# Altium project pcb_rev01.PrjPcb
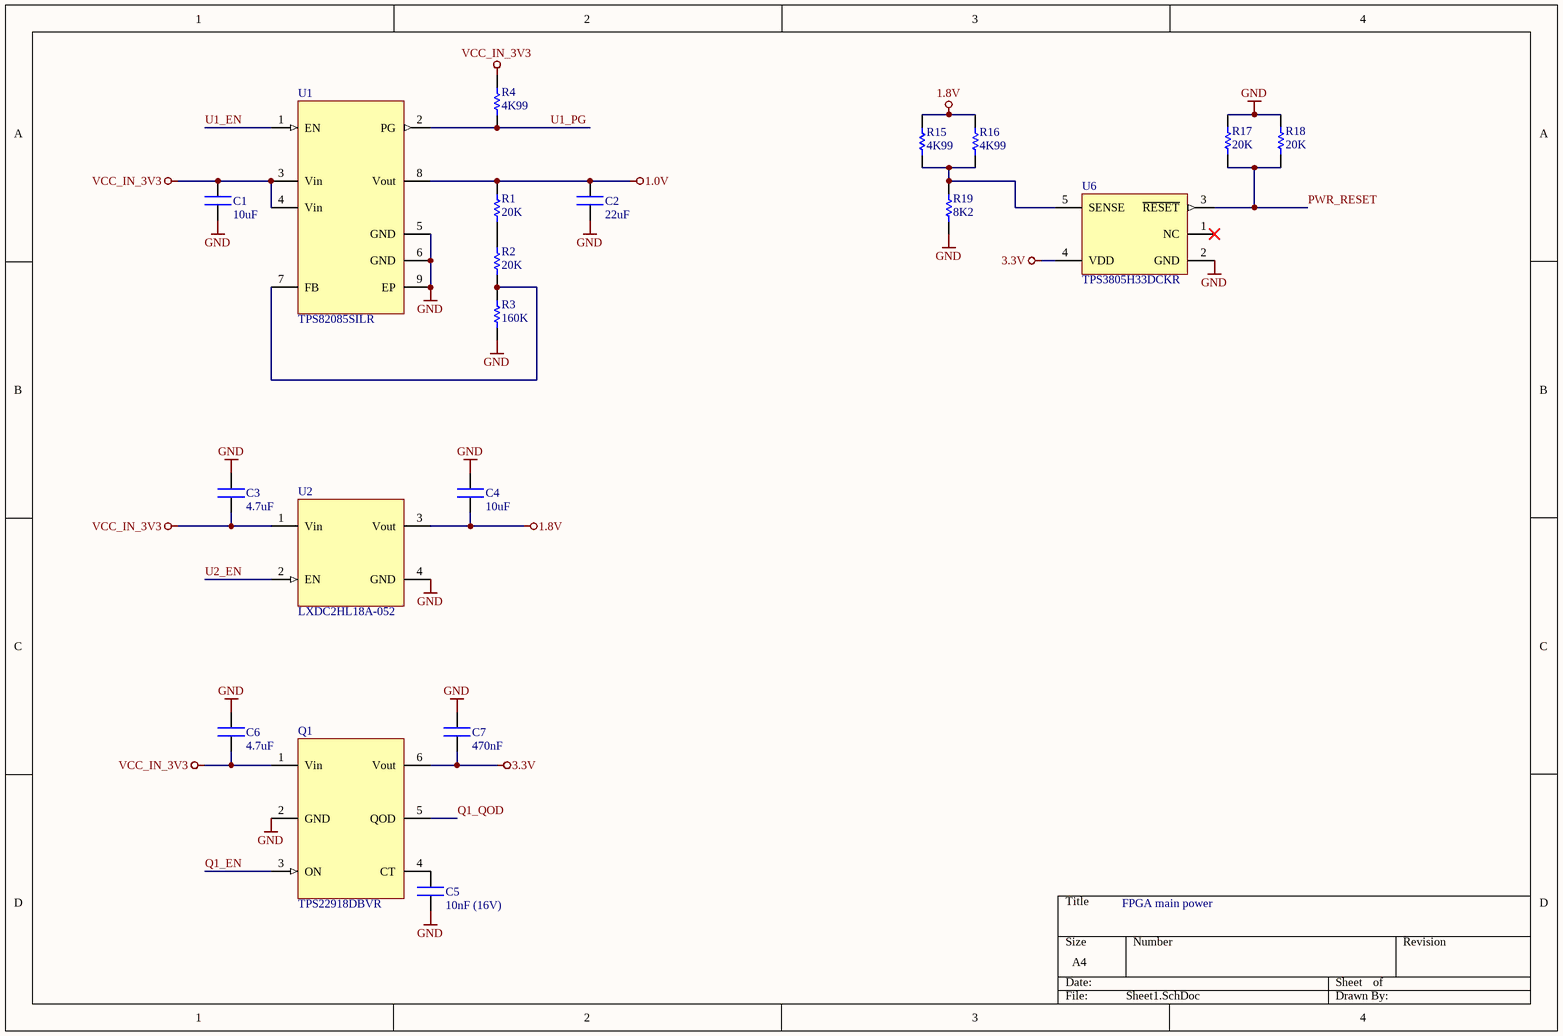
[diagram p0: Sheet1.SchDoc]
13 sheets, 174 parts. Net scope: global (net labels, ports and power ports of the same name join across sheets).
Board file: PCB1.PcbDoc
Sheets:
  Sheet1.SchDoc
  Sheet2.SchDoc
  Sheet3.SchDoc
  Sheet4.SchDoc
  Sheet5.SchDoc
  Sheet6.SchDoc
  Sheet7.SchDoc
  Sheet8.SchDoc
  Sheet9.SchDoc
  Sheet10.SchDoc
  Sheet11.SchDoc
  Sheet12.SchDoc
  Sheet13.SchDoc

## Sheet Sheet1.SchDoc
size A4

### Parts
C1  10uF  [CAPC1608X08N]
C2  22uF  [CAPC1608X08N]
C3  4.7uF  [CAPC1005X05N]
C4  10uF  [CAPC1608X08N]
C5  10nF (16V)  [CAPC1005X05N]
C6  4.7uF  [CAPC1005X05N]
C7  470nF  [CAPC1005X05N]
Q1  TPS22918DBVR  [TPS22918DBVR]
R1  20K  [RESC1005X05N]
R2  20K  [RESC1005X05N]
R3  160K  [RESC1005X05N]
R4  4K99  [RESC1005X05N]
R15  4K99  [RESC1005X05N]
R16  4K99  [RESC1005X05N]
R17  20K  [RESC1005X05N]
R18  20K  [RESC1005X05N]
R19  8K2  [RESC1005X05N]
U1  TPS82085SILR  [TPS82085SILR]
U2  LXDC2HL18A-052  [LXDC2HL18A-052]
U6  TPS3805H33DCKR  [TPS3805H33DCKR]

### Nets
1.0V: C2.2 R1.2 U1.8(Vout)
1.8V: C4.2 R15.2 R16.2 U2.3(Vout)
3.3V: C7.2 Q1.6(Vout) U6.4(VDD)
GND: C1.1 C2.1 C3.1 C4.1 C5.1 C6.1 C7.1 Q1.2(GND) R3.1 R17.1 R18.1 R19.1 U1.5(GND) U1.6(GND) U1.9(EP) U2.4(GND) U6.2(GND)
VCC_IN_3V3: C1.2 C3.2 C6.2 Q1.1(Vin) R4.2 U1.3(Vin) U1.4(Vin) U2.1(Vin)
PWR_RESET: R17.2 R18.2 U6.3(~{RESET})
Q1_EN: Q1.3(ON)
Q1_QOD: Q1.5(QOD)
U1_EN: U1.1(EN)
U1_PG: R4.1 U1.2(PG)
U2_EN: U2.2(EN)
NetC5_2: C5.2 Q1.4(CT)
NetR1_1: R1.1 R2.2
NetR2_1: R2.1 R3.2 U1.7(FB)
NetR15_1: R15.1 R16.1 R19.2 U6.5(SENSE)

Not connected (* = marked no-connect by the designer): U6 1(NC)*

### Notes on the sheet
- FPGA main power

### Library data of the parts
C1 C2 C4 = C0603: Ceramic Chip Capacitor
  C1 C4: Value: 10uF
  C2: Value: 22uF
C3 C5-C7 = C0402: Ceramic Chip Capacitor
  C3 C6: Value: 4.7uF
  C5: Value: 10nF (16V)
  C7: Value: 470nF
Q1 = TPS22918DBVR: 5.5-V, 2-A, 52-mΩ On-Resistance Load Switch
R1-R4 R15-R19 = R0402: Ceramic Chip Resistor
  R1 R2 R17 R18: Value: 20K
  R3: Value: 160K
  R4 R15 R16: Value: 4K99
  R19: Value: 8K2
U1 = TPS82085SILR: 3-A High Efficiency Step-Down Converter
U2 = LXDC2HL18A-052: Low power step-down DC-DC converter.
U6 = TPS3805H33DCKR: Dual Voltage Detector, 2 Supply Monitored, -40 to 85 degC, 5-pin SC70 (DCK), Green (RoHS & no Sb/Br); Manufacturer: Texas Instruments; # of supplies monitored: 2; Iq(Typ)(uA): 3; Output Driver Type / Reset Output: Active-low, Push-pull; Rating: Catalog; Reset Threshold Accuracy(%): 1.5; SubFamily: Supervisor and Reset IC; Threshold Voltage 1 (typ)(Typ)(V): 3.05; Threshold Voltage 2 (typ)(Typ)(V): Adjustable; VCC(Max)(V): 6; VCC(Min)(V): 1.3; DatasheetVersion: SLVS392A; PackageVersion: revG, Jan-2007; PackageReference: DCK5; PackageDescription: 5-Pin Plastic Small-Outline Package, 2 x 1.3 mm Body, 0.65 mm Pitch, 2.1 mm Lead Span; Supplier 1: Digi-Key; Supplier Part Number 1: 296-13407-2-ND; Supplier 2: Digi-Key; Supplier Part Number 2: 296-13407-1-ND; Supplier 3: Digi-Key; Supplier Part Number 3: 296-13407-6-ND; Supplier 4: Newark; Supplier Part Number 4: 77C0394; Supplier 5: Mouser; Supplier Part Number 5: 595-TPS3805H33DCKR; Mounting Technology: Surface Mount; Code_JEDEC: MO-203-AA; PartNumber: TPS3805H33DCKR; ComponentLink1Description: Datasheet; ComponentLink1URL: http://www.ti.com/general/docs/lit/getliterature.tsp?genericPartNumber=TPS3805H33&fileType=pdf

## Sheet Sheet2.SchDoc
size A4
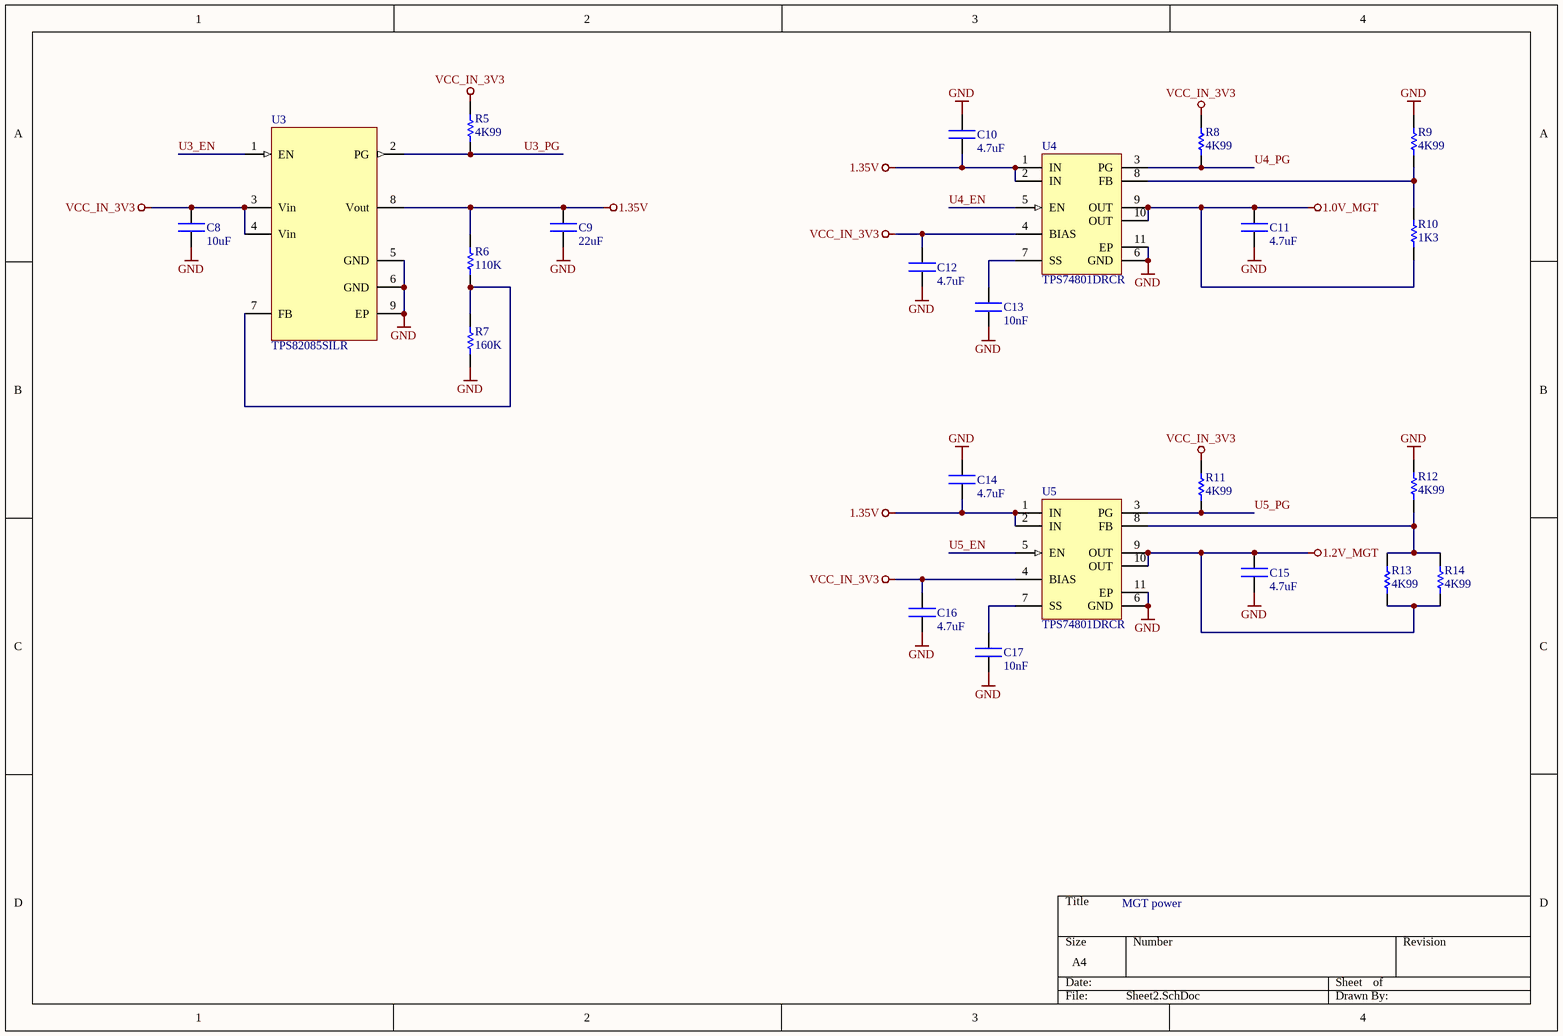
[diagram p1: Sheet2.SchDoc]

### Parts
C8  10uF  [CAPC1608X08N]
C9  22uF  [CAPC1608X08N]
C10  4.7uF  [CAPC1005X05N]
C11  4.7uF  [CAPC1005X05N]
C12  4.7uF  [CAPC1005X05N]
C13  10nF  [CAPC1005X05N]
C14  4.7uF  [CAPC1005X05N]
C15  4.7uF  [CAPC1005X05N]
C16  4.7uF  [CAPC1005X05N]
C17  10nF  [CAPC1005X05N]
R5  4K99  [RESC1005X05N]
R6  110K  [RESC1005X05N]
R7  160K  [RESC1005X05N]
R8  4K99  [RESC1005X05N]
R9  4K99  [RESC1005X05N]
R10  1K3  [RESC1005X05N]
R11  4K99  [RESC1005X05N]
R12  4K99  [RESC1005X05N]
R13  4K99  [RESC1005X05N]
R14  4K99  [RESC1005X05N]
U3  TPS82085SILR  [TPS82085SILR]
U4  TPS74801DRCR  [TPS74801DRCR]
U5  TPS74801DRCR  [TPS74801DRCR]

### Nets
1.0V_MGT: C11.2 R10.2 U4.9(OUT) U4.10(OUT)
1.2V_MGT: C15.2 R13.1 R14.1 U5.9(OUT) U5.10(OUT)
1.35V: C9.2 C10.2 C14.2 R6.2 U3.8(Vout) U4.1(IN) U4.2(IN) U5.1(IN) U5.2(IN)
GND: C8.1 C9.1 C10.1 C11.1 C12.1 C13.1 C14.1 C15.1 C16.1 C17.1 R7.1 R9.2 R12.1 U3.5(GND) U3.6(GND) U3.9(EP) U4.6(GND) U4.11(EP) U5.6(GND) U5.11(EP)
VCC_IN_3V3: C8.2 C12.2 C16.2 R5.2 R8.2 R11.2 U3.3(Vin) U3.4(Vin) U4.4(BIAS) U5.4(BIAS)
U3_EN: U3.1(EN)
U3_PG: R5.1 U3.2(PG)
U4_EN: U4.5(EN)
U4_PG: R8.1 U4.3(PG)
U5_EN: U5.5(EN)
U5_PG: R11.1 U5.3(PG)
NetC13_2: C13.2 U4.7(SS)
NetC17_2: C17.2 U5.7(SS)
NetR6_1: R6.1 R7.2 U3.7(FB)
NetR9_1: R9.1 R10.1 U4.8(FB)
NetR12_2: R12.2 R13.2 R14.2 U5.8(FB)

### Notes on the sheet
- MGT power

### Library data of the parts
C8 C9 = C0603: Ceramic Chip Capacitor
  C8: Value: 10uF
  C9: Value: 22uF
C10-C17 = C0402: Ceramic Chip Capacitor
  C10-C12 C14-C16: Value: 4.7uF
  C13 C17: Value: 10nF
R5-R14 = R0402: Ceramic Chip Resistor
  R5 R8 R9 R11-R14: Value: 4K99
  R6: Value: 110K
  R7: Value: 160K
  R10: Value: 1K3
U3 = TPS82085SILR: 3-A High Efficiency Step-Down Converter
U4 U5 = TPS74801DRCR: Single Output LDO, 1.5 A, Adjustable 0.8 to 3.6 V Output, 0.8 to 5.5 V Input, with Programmable Soft Start, 10-pin SON (DRC), -40 to 125 degC, Green (RoHS & no Sb/Br); Manufacturer: Texas Instruments; Accuracy(%): 2; Iout(Max)(A): 1.5; Iq(Typ)(mA): 1; Power Good: TRUE; Rating: Catalog; SubFamily: Single Channel LDO; Vdo(Typ)(mV): 60; Vin(Max)(V): 5.5; Vin(Min)(V): 0.8; Vout Adj(Max)(V): 3.6; DatasheetVersion: SBVS074J; PackageVersion: 4204102-3/L; PackageReference: DRC10-2400X1650TP; PackageDescription: 10-Pin Plastic Small Outline, Body 3 x 3 mm, Pitch 0.5 mm; Supplier 1: Digi-Key; Supplier Part Number 1: 296-21563-2-ND; Supplier 2: Digi-Key; Supplier Part Number 2: 296-21563-1-ND; Supplier 3: Digi-Key; Supplier Part Number 3: 296-21563-6-ND; Supplier 4: Newark; Supplier Part Number 4: 30M1868; Supplier 5: Mouser; Supplier Part Number 5: 595-TPS74801DRCR; Eco-Plan: Green (RoHS & no Sb/Br); Vout Adj(Min)(V): 0.8; Mounting Technology: Surface Mount; PartNumber: TPS74801DRCR; ComponentLink1Description: Manufacturer URL; ComponentLink1URL: http://www.ti.com/; ComponentLink2Description: Datasheet; ComponentLink2URL: http://www.ti.com/general/docs/lit/getliterature.tsp?genericPartNumber=TPS74801&fileType=pdf; ComponentLink3Description: Package Specification; ComponentLink3URL: http://www.ti.com/litv/pdf/mpds117k; ComponentLink4Description: URL Link1; ComponentLink4URL: Samples URL:http://www.ti.com/product/tps74801#samples

## Sheet Sheet3.SchDoc
size A4
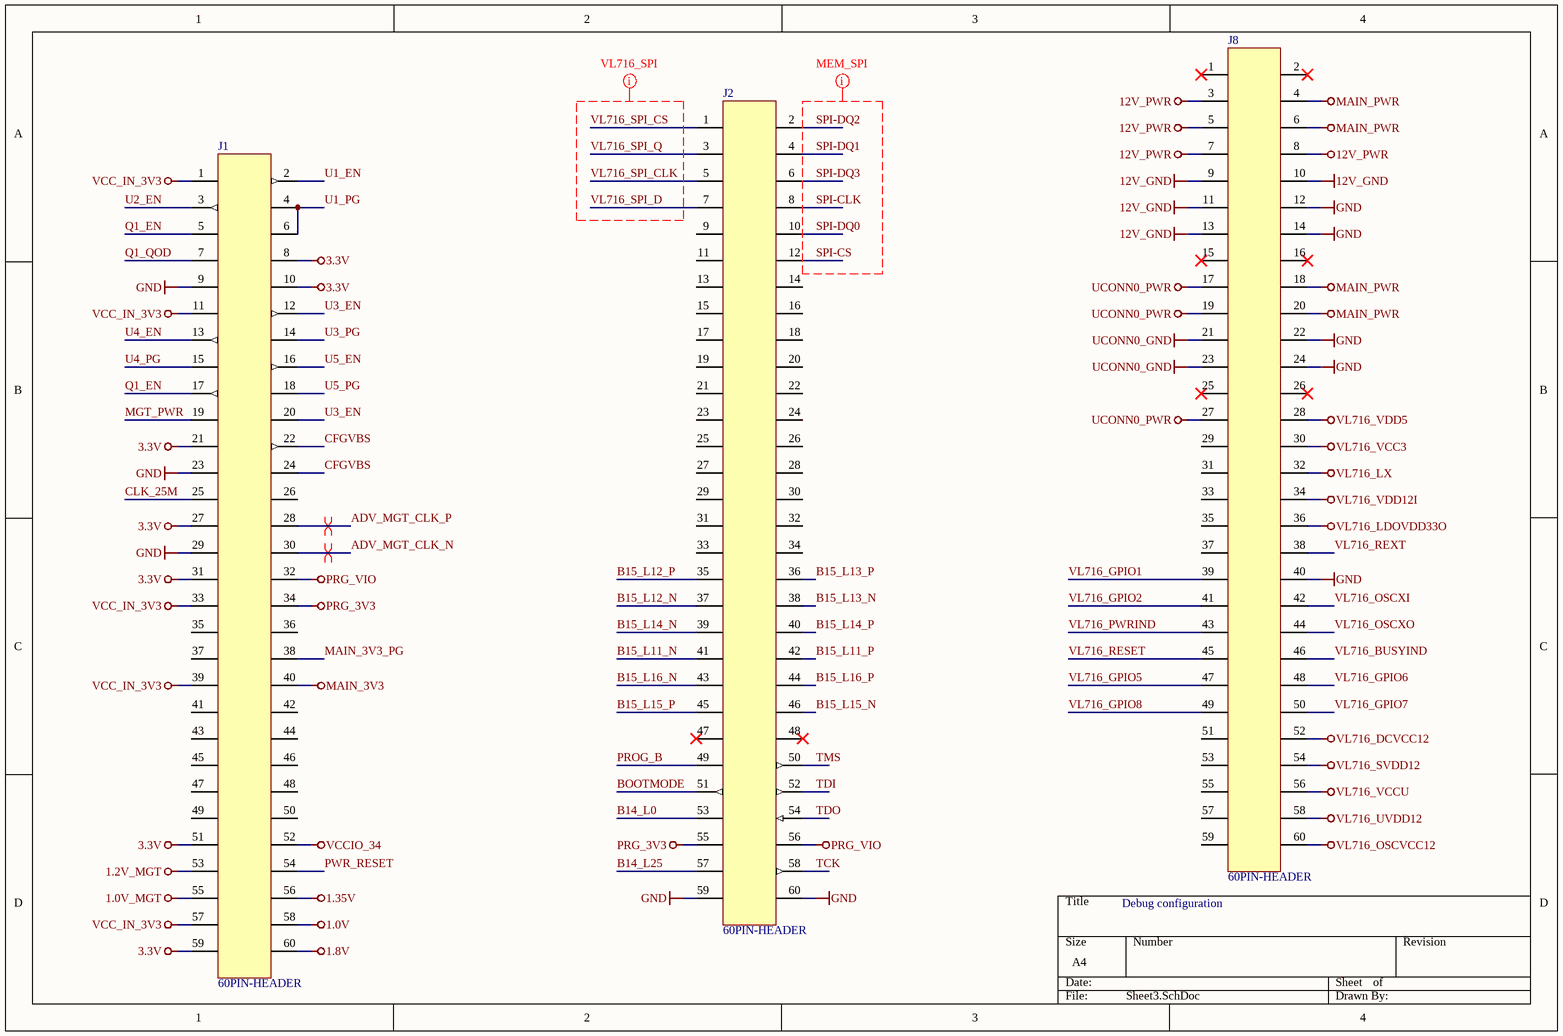
[diagram p2: Sheet3.SchDoc]

### Parts
J1  60PIN-HEADER  [60PIN-HEADER]
J2  60PIN-HEADER  [60PIN-HEADER]
J8  60PIN-HEADER  [60PIN-HEADER]

### Nets
1.0V: J1.58
1.0V_MGT: J1.55
1.2V_MGT: J1.53
1.8V: J1.60
1.35V: J1.56
3.3V: J1.8 J1.10 J1.21 J1.27 J1.31 J1.51 J1.59
12V_GND: J8.9 J8.10 J8.11 J8.13
12V_PWR: J8.3 J8.5 J8.7 J8.8
GND: J1.9 J1.23 J1.29 J2.59 J2.60 J8.12 J8.14 J8.22 J8.24 J8.40
MAIN_3V3: J1.40
MAIN_PWR: J8.4 J8.6 J8.18 J8.20
PRG_3V3: J1.34 J2.55
PRG_VIO: J1.32 J2.56
UCONN0_GND: J8.21 J8.23
UCONN0_PWR: J8.17 J8.19 J8.27
VCC_IN_3V3: J1.1 J1.11 J1.33 J1.39 J1.57
VCCIO_34: J1.52
VL716_DCVCC12: J8.52
VL716_LDOVDD33O: J8.36
VL716_LX: J8.32
VL716_OSCVCC12: J8.60
VL716_SVDD12: J8.54
VL716_UVDD12: J8.58
VL716_VCC3: J8.30
VL716_VCCU: J8.56
VL716_VDD5: J8.28
VL716_VDD12I: J8.34
ADV_MGT_CLK_N: J1.30
ADV_MGT_CLK_P: J1.28
B14_L0: J2.53
B14_L25: J2.57
B15_L11_N: J2.41
B15_L11_P: J2.42
B15_L12_N: J2.37
B15_L12_P: J2.35
B15_L13_N: J2.38
B15_L13_P: J2.36
B15_L14_N: J2.39
B15_L14_P: J2.40
B15_L15_N: J2.46
B15_L15_P: J2.45
B15_L16_N: J2.43
B15_L16_P: J2.44
BOOTMODE: J2.51
CFGVBS: J1.22 J1.24
CLK_25M: J1.25
MAIN_3V3_PG: J1.38
MGT_PWR: J1.19
PROG_B: J2.49
PWR_RESET: J1.54
Q1_EN: J1.5 J1.17
Q1_QOD: J1.7
SPI-CLK: J2.8
SPI-CS: J2.12
SPI-DQ0: J2.10
SPI-DQ1: J2.4
SPI-DQ2: J2.2
SPI-DQ3: J2.6
TCK: J2.58
TDI: J2.52
TDO: J2.54
TMS: J2.50
U1_EN: J1.2
U1_PG: J1.4 J1.6
U2_EN: J1.3
U3_EN: J1.12 J1.20
U3_PG: J1.14
U4_EN: J1.13
U4_PG: J1.15
U5_EN: J1.16
U5_PG: J1.18
VL716_BUSYIND: J8.46
VL716_GPIO1: J8.39
VL716_GPIO2: J8.41
VL716_GPIO5: J8.47
VL716_GPIO6: J8.48
VL716_GPIO7: J8.50
VL716_GPIO8: J8.49
VL716_OSCXI: J8.42
VL716_OSCXO: J8.44
VL716_PWRIND: J8.43
VL716_RESET: J8.45
VL716_REXT: J8.38
VL716_SPI_CLK: J2.5
VL716_SPI_CS: J2.1
VL716_SPI_D: J2.7
VL716_SPI_Q: J2.3

Not connected (* = marked no-connect by the designer): J1 26 35 36 37 41 42 43 44 45 46 47 48 49 50; J2 9 11 13 14 15 16 17 18 19 20 21 22 23 24 25 26 27 28 29 30 31 32 33 34 47* 48*; J8 1* 2* 15* 16* 25* 26* 29 31 33 35 37 51 53 55 57 59

### Layout directives
differential pair: ADV_MGT_CLK_N, ADV_MGT_CLK_P
net class VL716_SPI: VL716_SPI_CLK, VL716_SPI_CS, VL716_SPI_D, VL716_SPI_Q
net class MEM_SPI: SPI-CLK, SPI-CS, SPI-DQ0, SPI-DQ1, SPI-DQ2, SPI-DQ3

### Notes on the sheet
- (near J8) Debug configuration

### Library data of the parts
J1 J2 J8 = 60PIN-HEADER: 2.54mm 60-pin header

## Sheet Sheet4.SchDoc
size A4
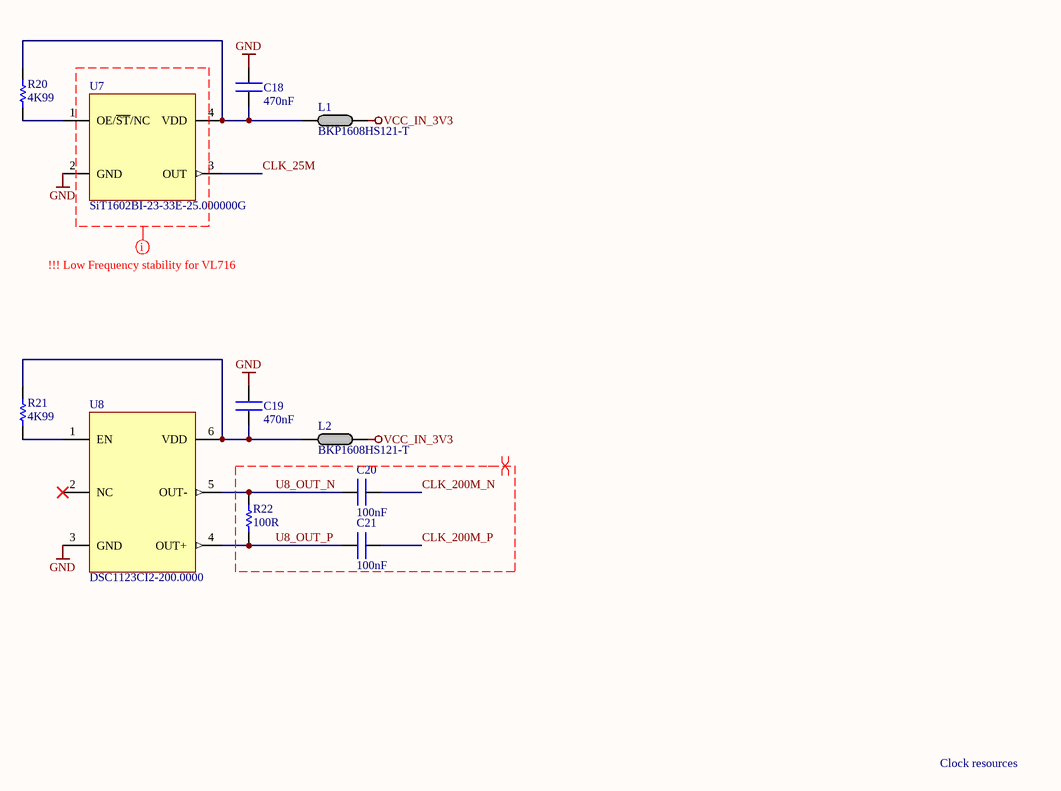
[diagram p3: Sheet4.SchDoc]

### Parts
C18  470nF  [CAPC1005X05N]
C19  470nF  [CAPC1005X05N]
C20  100nF  [CAPC1005X05N]
C21  100nF  [CAPC1005X05N]
L1  BKP1608HS121-T  [INDC1608X08N]
L2  BKP1608HS121-T  [INDC1608X08N]
R20  4K99  [RESC1005X05N]
R21  4K99  [RESC1005X05N]
R22  100R  [RESC1005X05N]
U7  SiT1602BI-23-33E-25.000000G  [SiT1602BI-23-33E-25.000000G]
U8  DSC1123CI2-200.0000  [DSC1123CI2-200.0000]

### Nets
GND: C18.2 C19.2 U7.2(GND) U8.3(GND)
VCC_IN_3V3: L1.2 L2.2
CLK_25M: U7.3(OUT)
CLK_200M_N: C20.1
CLK_200M_P: C21.1
U8_OUT_N: C20.2 R22.1 U8.5(OUT-)
U8_OUT_P: C21.2 R22.2 U8.4(OUT+)
NetC18_1: C18.1 L1.1 R20.1 U7.4(VDD)
NetC19_1: C19.1 L2.1 R21.1 U8.6(VDD)
NetR20_2: R20.2 U7.1(OE/~{ST}/NC)
NetR21_2: R21.2 U8.1(EN)

Not connected (* = marked no-connect by the designer): U8 2(NC)*

### Layout directives
differential pair: CLK_200M_N, CLK_200M_P, U8_OUT_N, U8_OUT_P
mark named !!! Low Frequency stability for VL716: (no net found under the mark)

### Notes on the sheet
- Clock resources

### Library data of the parts
C18-C21 = C0402: Ceramic Chip Capacitor
  C18 C19: Value: 470nF
  C20 C21: Value: 100nF
L1 L2 = BKP1608HS121-T: MULTILAYER CHIP BEAD INDUCTOR FOR POWER LINES
R20-R22 = R0402: Ceramic Chip Resistor
  R20 R21: Value: 4K99
  R22: Value: 100R
U7 = SiT1602BI-23-33E-25.000000G: Low Power, Standard Frequency Oscillator
U8 = DSC1123CI2-200.0000: Low-Jitter Precision LVDS Oscillator

## Sheet Sheet5.SchDoc
size A4
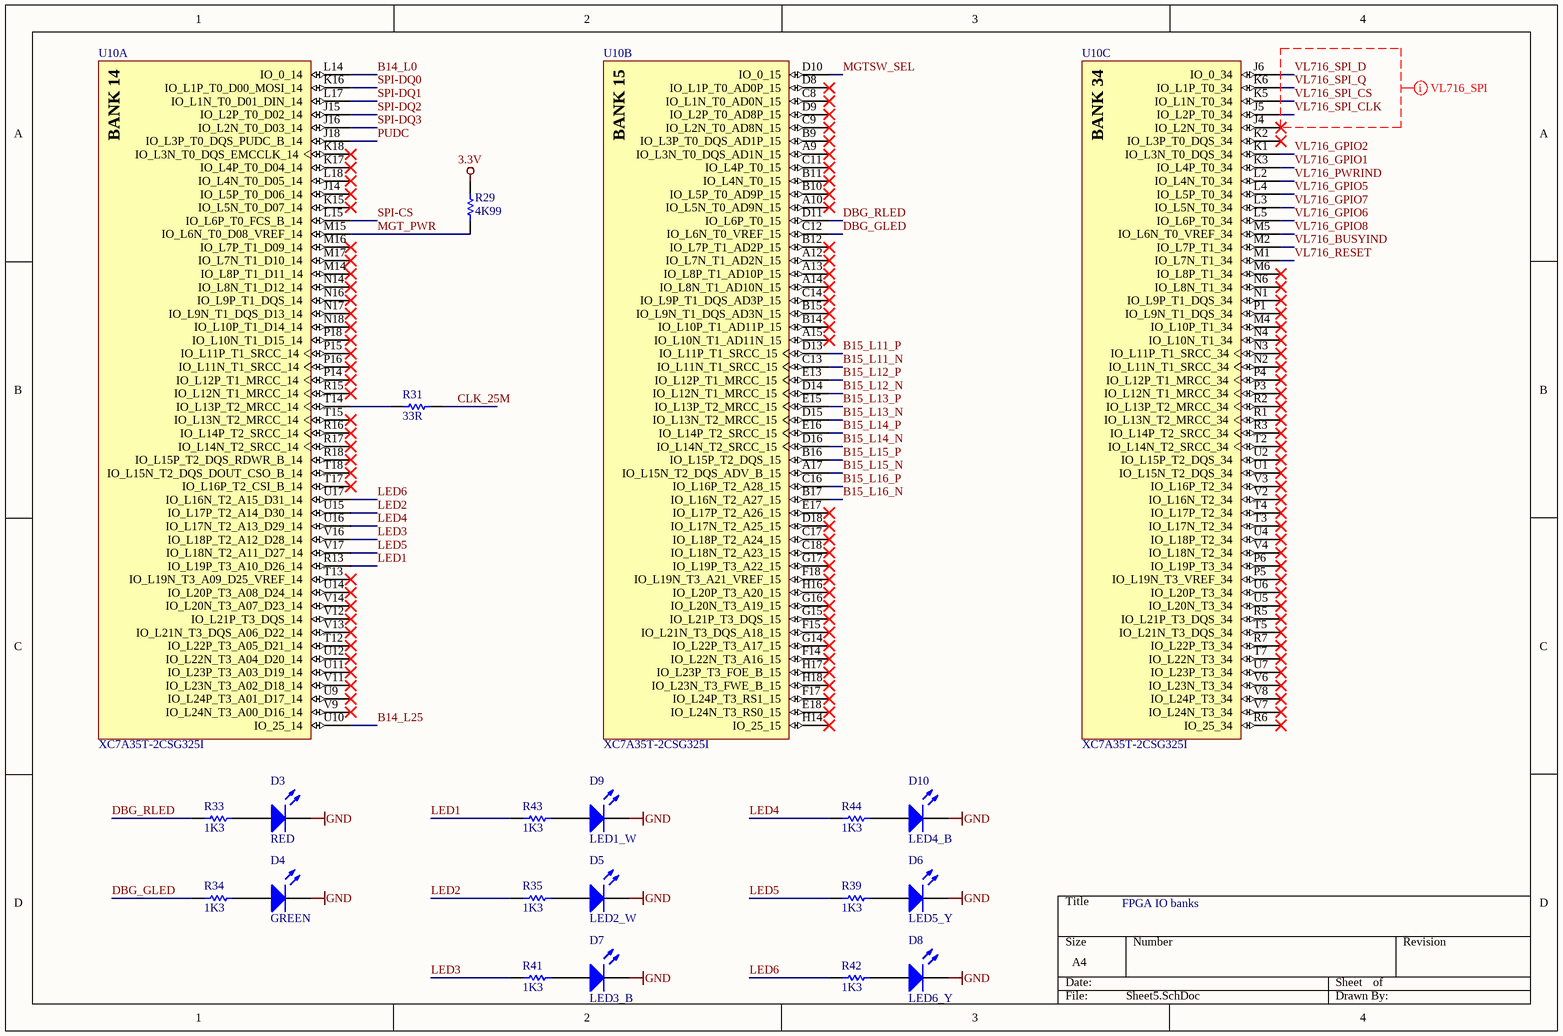
[diagram p4: Sheet5.SchDoc]

### Parts
D3  RED  [LEDC2012X10N]
D4  GREEN  [LEDC2012X10N]
D5  LED2_W  [LEDC2012X10N]
D6  LED5_Y  [LEDC2012X10N]
D7  LED3_B  [LEDC2012X10N]
D8  LED6_Y  [LEDC2012X10N]
D9  LED1_W  [LEDC2012X10N]
D10  LED4_B  [LEDC2012X10N]
R29  4K99  [RESC1005X05N]
R31  33R  [RESC1005X05N]
R33  1K3  [RESC1005X05N]
R34  1K3  [RESC1005X05N]
R35  1K3  [RESC1005X05N]
R39  1K3  [RESC1005X05N]
R41  1K3  [RESC1005X05N]
R42  1K3  [RESC1005X05N]
R43  1K3  [RESC1005X05N]
R44  1K3  [RESC1005X05N]
U10  XC7A35T-2CSG325I  [XC7A35T-2CSG325I]  (parts A,B,C of 9)

### Nets
3.3V: R29.1
GND: D3.1(K) D4.1(K) D5.1(K) D6.1(K) D7.1(K) D8.1(K) D9.1(K) D10.1(K)
B14_L0: U10.L14(IO_0_14)
B14_L25: U10.U10(IO_25_14)
B15_L11_N: U10.C13(IO_L11N_T1_SRCC_15)
B15_L11_P: U10.D13(IO_L11P_T1_SRCC_15)
B15_L12_N: U10.D14(IO_L12N_T1_MRCC_15)
B15_L12_P: U10.E13(IO_L12P_T1_MRCC_15)
B15_L13_N: U10.D15(IO_L13N_T2_MRCC_15)
B15_L13_P: U10.E15(IO_L13P_T2_MRCC_15)
B15_L14_N: U10.D16(IO_L14N_T2_SRCC_15)
B15_L14_P: U10.E16(IO_L14P_T2_SRCC_15)
B15_L15_N: U10.A17(IO_L15N_T2_DQS_ADV_B_15)
B15_L15_P: U10.B16(IO_L15P_T2_DQS_15)
B15_L16_N: U10.B17(IO_L16N_T2_A27_15)
B15_L16_P: U10.C16(IO_L16P_T2_A28_15)
CLK_25M: R31.2
DBG_GLED: R34.2 U10.C12(IO_L6N_T0_VREF_15)
DBG_RLED: R33.2 U10.D11(IO_L6P_T0_15)
LED1: R43.2 U10.R13(IO_L19P_T3_A10_D26_14)
LED2: R35.2 U10.U15(IO_L17P_T2_A14_D30_14)
LED3: R41.2 U10.V16(IO_L18P_T2_A12_D28_14)
LED4: R44.2 U10.U16(IO_L17N_T2_A13_D29_14)
LED5: R39.2 U10.V17(IO_L18N_T2_A11_D27_14)
LED6: R42.2 U10.U17(IO_L16N_T2_A15_D31_14)
MGT_PWR: R29.2 U10.M15(IO_L6N_T0_D08_VREF_14)
MGTSW_SEL: U10.D10(IO_0_15)
PUDC: U10.J18(IO_L3P_T0_DQS_PUDC_B_14)
SPI-CS: U10.L15(IO_L6P_T0_FCS_B_14)
SPI-DQ0: U10.K16(IO_L1P_T0_D00_MOSI_14)
SPI-DQ1: U10.L17(IO_L1N_T0_D01_DIN_14)
SPI-DQ2: U10.J15(IO_L2P_T0_D02_14)
SPI-DQ3: U10.J16(IO_L2N_T0_D03_14)
VL716_BUSYIND: U10.M2(IO_L7P_T1_34)
VL716_GPIO1: U10.K3(IO_L4P_T0_34)
VL716_GPIO2: U10.K1(IO_L3N_T0_DQS_34)
VL716_GPIO5: U10.L4(IO_L5P_T0_34)
VL716_GPIO6: U10.L5(IO_L6P_T0_34)
VL716_GPIO7: U10.L3(IO_L5N_T0_34)
VL716_GPIO8: U10.M5(IO_L6N_T0_VREF_34)
VL716_PWRIND: U10.L2(IO_L4N_T0_34)
VL716_RESET: U10.M1(IO_L7N_T1_34)
VL716_SPI_CLK: U10.J5(IO_L2P_T0_34)
VL716_SPI_CS: U10.K5(IO_L1N_T0_34)
VL716_SPI_D: U10.J6(IO_0_34)
VL716_SPI_Q: U10.K6(IO_L1P_T0_34)
NetD3_2: D3.2(A) R33.1
NetD4_2: D4.2(A) R34.1
NetD5_2: D5.2(A) R35.1
NetD6_2: D6.2(A) R39.1
NetD7_2: D7.2(A) R41.1
NetD8_2: D8.2(A) R42.1
NetD9_2: D9.2(A) R43.1
NetD10_2: D10.2(A) R44.1
NetR31_1: R31.1 U10.T14(IO_L13P_T2_MRCC_14)

Not connected (* = marked no-connect by the designer): U10 A9(IO_L3N_T0_DQS_AD1N_15)* A10(IO_L5N_T0_AD9N_15)* A12(IO_L7N_T1_AD2N_15)* A13(IO_L8P_T1_AD10P_15)* A14(IO_L8N_T1_AD10N_15)* A15(IO_L10N_T1_AD11N_15)* B9(IO_L3P_T0_DQS_AD1P_15)* B10(IO_L5P_T0_AD9P_15)* B11(IO_L4N_T0_15)* B12(IO_L7P_T1_AD2P_15)* B14(IO_L10P_T1_AD11P_15)* B15(IO_L9N_T1_DQS_AD3N_15)* C8(IO_L1N_T0_AD0N_15)* C9(IO_L2N_T0_AD8N_15)* C11(IO_L4P_T0_15)* C14(IO_L9P_T1_DQS_AD3P_15)* C17(IO_L18P_T2_A24_15)* C18(IO_L18N_T2_A23_15)* D8(IO_L1P_T0_AD0P_15)* D9(IO_L2P_T0_AD8P_15)* D18(IO_L17N_T2_A25_15)* E17(IO_L17P_T2_A26_15)* E18(IO_L24N_T3_RS0_15)* F14(IO_L22N_T3_A16_15)* F15(IO_L21N_T3_DQS_A18_15)* F17(IO_L24P_T3_RS1_15)* F18(IO_L19N_T3_A21_VREF_15)* G14(IO_L22P_T3_A17_15)* G15(IO_L21P_T3_DQS_15)* G16(IO_L20N_T3_A19_15)* G17(IO_L19P_T3_A22_15)* H14(IO_25_15)* H16(IO_L20P_T3_A20_15)* H17(IO_L23P_T3_FOE_B_15)* H18(IO_L23N_T3_FWE_B_15)* J4(IO_L2N_T0_34)* J14(IO_L5P_T0_D06_14)* K2(IO_L3P_T0_DQS_34)* K15(IO_L5N_T0_D07_14)* K17(IO_L4P_T0_D04_14)* K18(IO_L3N_T0_DQS_EMCCLK_14)* L18(IO_L4N_T0_D05_14)* M4(IO_L10P_T1_34)* M6(IO_L8P_T1_34)* M14(IO_L8P_T1_D11_14)* M16(IO_L7P_T1_D09_14)* M17(IO_L7N_T1_D10_14)* N1(IO_L9P_T1_DQS_34)* N2(IO_L11N_T1_SRCC_34)* N3(IO_L11P_T1_SRCC_34)* N4(IO_L10N_T1_34)* N6(IO_L8N_T1_34)* N14(IO_L8N_T1_D12_14)* N16(IO_L9P_T1_DQS_14)* N17(IO_L9N_T1_DQS_D13_14)* N18(IO_L10P_T1_D14_14)* P1(IO_L9N_T1_DQS_34)* P3(IO_L12N_T1_MRCC_34)* P4(IO_L12P_T1_MRCC_34)* P5(IO_L19N_T3_VREF_34)* P6(IO_L19P_T3_34)* P14(IO_L12P_T1_MRCC_14)* P15(IO_L11P_T1_SRCC_14)* P16(IO_L11N_T1_SRCC_14)* P18(IO_L10N_T1_D15_14)* R1(IO_L13N_T2_MRCC_34)* R2(IO_L13P_T2_MRCC_34)* R3(IO_L14P_T2_SRCC_34)* R5(IO_L21P_T3_DQS_34)* R6(IO_25_34)* R7(IO_L22P_T3_34)* R15(IO_L12N_T1_MRCC_14)* R16(IO_L14P_T2_SRCC_14)* R17(IO_L14N_T2_SRCC_14)* R18(IO_L15P_T2_DQS_RDWR_B_14)* T2(IO_L14N_T2_SRCC_34)* T3(IO_L17N_T2_34)* T4(IO_L17P_T2_34)* T5(IO_L21N_T3_DQS_34)* T7(IO_L22N_T3_34)* T12(IO_L22P_T3_A05_D21_14)* T13(IO_L19N_T3_A09_D25_VREF_14)* T15(IO_L13N_T2_MRCC_14)* T17(IO_L16P_T2_CSI_B_14)* T18(IO_L15N_T2_DQS_DOUT_CSO_B_14)* U1(IO_L15N_T2_DQS_34)* U2(IO_L15P_T2_DQS_34)* U4(IO_L18P_T2_34)* U5(IO_L20N_T3_34)* U6(IO_L20P_T3_34)* U7(IO_L23P_T3_34)* U9(IO_L24P_T3_A01_D17_14)* U11(IO_L23P_T3_A03_D19_14)* U12(IO_L22N_T3_A04_D20_14)* U14(IO_L20P_T3_A08_D24_14)* V2(IO_L16N_T2_34)* V3(IO_L16P_T2_34)* V4(IO_L18N_T2_34)* V6(IO_L23N_T3_34)* V7(IO_L24N_T3_34)* V8(IO_L24P_T3_34)* V9(IO_L24N_T3_A00_D16_14)* V11(IO_L23N_T3_A02_D18_14)* V12(IO_L21P_T3_DQS_14)* V13(IO_L21N_T3_DQS_A06_D22_14)* V14(IO_L20N_T3_A07_D23_14)*

### Layout directives
net class VL716_SPI: VL716_SPI_CLK, VL716_SPI_CS, VL716_SPI_D, VL716_SPI_Q

### Notes on the sheet
- FPGA IO banks
- (in symbol XC7A35T-2CSG325I, part A) BANK 14
- (in symbol XC7A35T-2CSG325I, part B) BANK 15
- (in symbol XC7A35T-2CSG325I, part C) BANK 34

### Library data of the parts
D3 D5-D10 = LED0805: SMD chip LED
  D3: Text: RED
  D5: Text: LED2_W
  D6: Text: LED5_Y
  D7: Text: LED3_B
  D8: Text: LED6_Y
  D9: Text: LED1_W
  D10: Text: LED4_B
D4 = LED0805: SMD chip LED; Text: DONE
R29 R31 R33-R35 R39 R41-R44 = R0402: Ceramic Chip Resistor
  R29: Value: 4K99
  R31: Value: 33R
  R33-R35 R39 R41-R44: Value: 1K3
U10 = XC7A35T-2CSG325I: Artix-7 FPGA, 150 User I/Os, 4 GTP, 324-Ball BGA, Speed Grade 2, Industrial Grade, Pb-Free; Manufacturer: Xilinx; Total Block RAM: 1800 Kb; GTP: 4; Clock Mgmt Tiles (CMTs): 5; Logic Cells: 33280; Available User I/O: 150; Speed Grades: 2; DatasheetVersion: v1.15; PackageVersion: Rev. 1.11; PackageReference: CSG-325; PackageDescription: 324-Ball Wire-Bond Chip-Scale BGA, Body 15 x 15 mm, Pitch 0.8 mm; Maximum Distributed RAM: 400 Kb; Operating Temperature Range: Industrial; NexusDeviceID: XC7A35T-2CSG325I; Mounting Technology: Surface Mount; PartNumber: XC7A35T-2CSG325I; ComponentLink1Description: Manufacturer URL; ComponentLink1URL: http://www.xilinx.com/; ComponentLink2Description: Datasheet; ComponentLink2URL: http://www.xilinx.com/support/documentation/data_sheets/ds180_7Series_Overview.pdf; ComponentLink3Description: Package Specification; ComponentLink3URL: http://www.xilinx.com/support/documentation/user_guides/ug475_7Series_Pkg_Pinout.pdf; ComponentLink4Description: DC and Switching Characteristics; ComponentLink4URL: http://www.xilinx.com/support/documentation/data_sheets/ds181_Artix_7_Data_Sheet.pdf; ComponentLink5Description: Package File; ComponentLink5URL: http://www.xilinx.com/support/packagefiles/a7packages/xc7a200tsbg484pkg.txt; ComponentLink6Description: Packaging and Pinout; ComponentLink6URL: http://www.xilinx.com/support/documentation/user_guides/ug475_7Series_Pkg_Pinout.pdf

## Sheet Sheet6.SchDoc
size A4
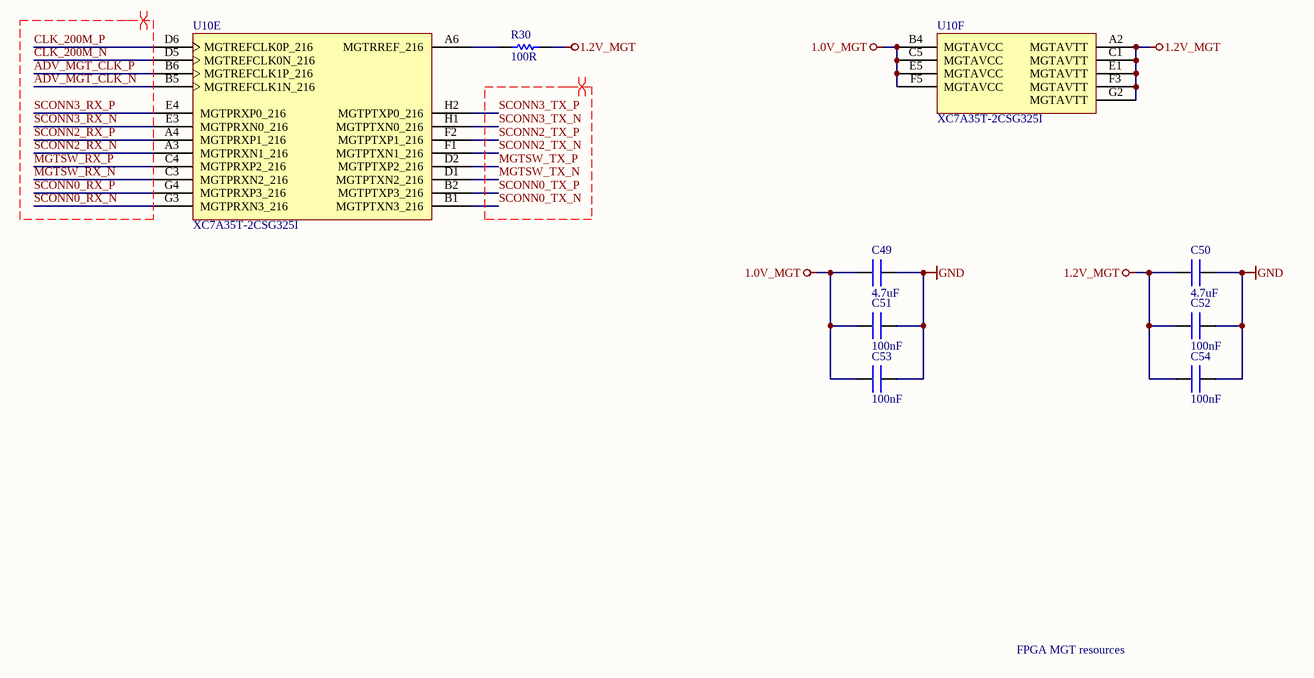
[diagram p5: Sheet6.SchDoc]

### Parts
C49  4.7uF  [CAPC1608X08N]
C50  4.7uF  [CAPC1608X08N]
C51  100nF  [CAPC1005X05L]
C52  100nF  [CAPC1005X05L]
C53  100nF  [CAPC1005X05L]
C54  100nF  [CAPC1005X05L]
R30  100R  [RESC1005X05N]
U10  XC7A35T-2CSG325I  [XC7A35T-2CSG325I]  (parts E,F of 9)

### Nets
1.0V_MGT: C49.2 C51.2 C53.2 U10.B4(MGTAVCC) U10.C5(MGTAVCC) U10.E5(MGTAVCC) U10.F5(MGTAVCC)
1.2V_MGT: C50.2 C52.2 C54.2 R30.1 U10.A2(MGTAVTT) U10.C1(MGTAVTT) U10.E1(MGTAVTT) U10.F3(MGTAVTT) U10.G2(MGTAVTT)
GND: C49.1 C50.1 C51.1 C52.1 C53.1 C54.1
ADV_MGT_CLK_N: U10.B5(MGTREFCLK1N_216)
ADV_MGT_CLK_P: U10.B6(MGTREFCLK1P_216)
CLK_200M_N: U10.D5(MGTREFCLK0N_216)
CLK_200M_P: U10.D6(MGTREFCLK0P_216)
MGTSW_RX_N: U10.C3(MGTPRXN2_216)
MGTSW_RX_P: U10.C4(MGTPRXP2_216)
MGTSW_TX_N: U10.D1(MGTPTXN2_216)
MGTSW_TX_P: U10.D2(MGTPTXP2_216)
SCONN0_RX_N: U10.G3(MGTPRXN3_216)
SCONN0_RX_P: U10.G4(MGTPRXP3_216)
SCONN0_TX_N: U10.B1(MGTPTXN3_216)
SCONN0_TX_P: U10.B2(MGTPTXP3_216)
SCONN2_RX_N: U10.A3(MGTPRXN1_216)
SCONN2_RX_P: U10.A4(MGTPRXP1_216)
SCONN2_TX_N: U10.F1(MGTPTXN1_216)
SCONN2_TX_P: U10.F2(MGTPTXP1_216)
SCONN3_RX_N: U10.E3(MGTPRXN0_216)
SCONN3_RX_P: U10.E4(MGTPRXP0_216)
SCONN3_TX_N: U10.H1(MGTPTXN0_216)
SCONN3_TX_P: U10.H2(MGTPTXP0_216)
NetR30_2: R30.2 U10.A6(MGTRREF_216)

### Layout directives
differential pair: ADV_MGT_CLK_N, ADV_MGT_CLK_P, CLK_200M_N, CLK_200M_P, MGTSW_RX_N, MGTSW_RX_P, MGTSW_TX_N, MGTSW_TX_P, SCONN0_RX_N, SCONN0_RX_P, SCONN0_TX_N, SCONN0_TX_P, SCONN2_RX_N, SCONN2_RX_P, SCONN2_TX_N, SCONN2_TX_P, SCONN3_RX_N, SCONN3_RX_P, SCONN3_TX_N, SCONN3_TX_P

### Notes on the sheet
- FPGA MGT resources

### Library data of the parts
C49 C50 = C0603: Ceramic Chip Capacitor; Value: 4.7uF
C51-C54 = C0402: Ceramic Chip Capacitor; Value: 100nF
R30 = R0402: Ceramic Chip Resistor; Value: 100R
U10 = XC7A35T-2CSG325I: as U10 on sheet Sheet5; DatasheetVersion: v1.15; PackageVersion: Rev. 1.11; PackageReference: CSG-325; PackageDescription: 324-Ball Wire-Bond Chip-Scale BGA, Body 15 x 15 mm, Pitch 0.8 mm; Maximum Distributed RAM: 400 Kb; Operating Temperature Range: Industrial; NexusDeviceID: XC7A35T-2CSG325I; Mounting Technology: Surface Mount; PartNumber: XC7A35T-2CSG325I; ComponentLink1Description: Manufacturer URL; ComponentLink1URL: http://www.xilinx.com/; ComponentLink2Description: Datasheet; ComponentLink2URL: http://www.xilinx.com/support/documentation/data_sheets/ds180_7Series_Overview.pdf; ComponentLink3Description: Package Specification; ComponentLink3URL: http://www.xilinx.com/support/documentation/user_guides/ug475_7Series_Pkg_Pinout.pdf; ComponentLink4Description: DC and Switching Characteristics; ComponentLink4URL: http://www.xilinx.com/support/documentation/data_sheets/ds181_Artix_7_Data_Sheet.pdf; ComponentLink5Description: Package File; ComponentLink5URL: http://www.xilinx.com/support/packagefiles/a7packages/xc7a200tsbg484pkg.txt; ComponentLink6Description: Packaging and Pinout; ComponentLink6URL: http://www.xilinx.com/support/documentation/user_guides/ug475_7Series_Pkg_Pinout.pdf

## Sheet Sheet7.SchDoc
size A4
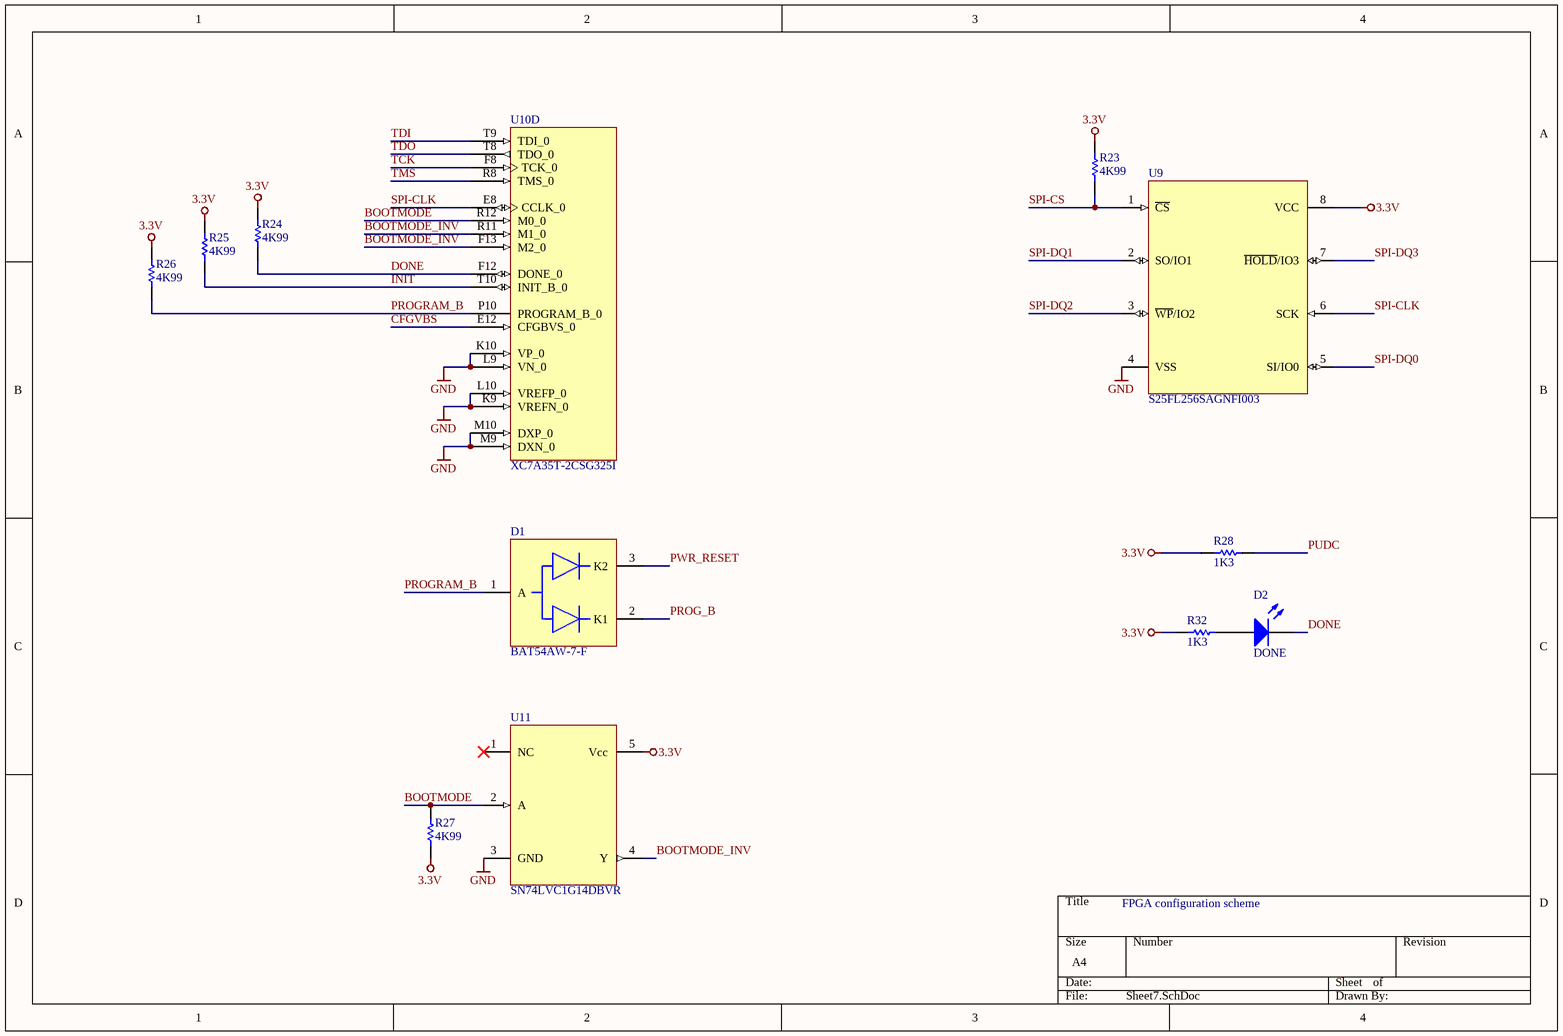
[diagram p6: Sheet7.SchDoc]

### Parts
D1  BAT54AW-7-F  [BAT54AW-7-F]
D2  DONE  [LEDC2012X10N]
R23  4K99  [RESC1005X05N]
R24  4K99  [RESC1005X05N]
R25  4K99  [RESC1005X05N]
R26  4K99  [RESC1005X05N]
R27  4K99  [RESC1005X05N]
R28  1K3  [RESC1005X05N]
R32  1K3  [RESC1005X05N]
U9  S25FL256SAGNFI003  [S25FL256SAGNFI003]
U10  XC7A35T-2CSG325I  [XC7A35T-2CSG325I]  (part D of 9)
U11  SN74LVC1G14DBVR  [SN74LVC1G14DBVR]

### Nets
3.3V: R23.1 R24.1 R25.1 R26.1 R27.1 R28.2 R32.2 U9.8(VCC) U11.5(Vcc)
GND: U9.4(VSS) U10.K9(VREFN_0) U10.K10(VP_0) U10.L9(VN_0) U10.L10(VREFP_0) U10.M9(DXN_0) U10.M10(DXP_0) U11.3(GND)
BOOTMODE: R27.2 U10.R12(M0_0) U11.2(A)
BOOTMODE_INV: U10.F13(M2_0) U10.R11(M1_0) U11.4(Y)
CFGVBS: U10.E12(CFGBVS_0)
DONE: D2.1(K) R24.2 U10.F12(DONE_0)
INIT: R25.2 U10.T10(INIT_B_0)
PROG_B: D1.2(K1)
PROGRAM_B: D1.1(A) R26.2 U10.P10(PROGRAM_B_0)
PUDC: R28.1
PWR_RESET: D1.3(K2)
SPI-CLK: U9.6(SCK) U10.E8(CCLK_0)
SPI-CS: R23.2 U9.1(~{CS})
SPI-DQ0: U9.5(SI/IO0)
SPI-DQ1: U9.2(SO/IO1)
SPI-DQ2: U9.3(~{WP}/IO2)
SPI-DQ3: U9.7(~{HOLD}/IO3)
TCK: U10.F8(TCK_0)
TDI: U10.T9(TDI_0)
TDO: U10.T8(TDO_0)
TMS: U10.R8(TMS_0)
NetD2_2: D2.2(A) R32.1

Not connected (* = marked no-connect by the designer): U11 1(NC)*

### Notes on the sheet
- FPGA configuration scheme

### Library data of the parts
D1 = BAT54AW-7-F: SCHOTTKY BARRIER DIODE
D2 = LED0805: SMD chip LED; Text: DONE
R23-R28 R32 = R0402: Ceramic Chip Resistor
  R23-R27: Value: 4K99
  R28 R32: Value: 1K3
U9 = S25FL256SAGNFI003: 256 Mbit (32 Mbyte)  3.0V SPI Flash Memory
U10 = XC7A35T-2CSG325I: as U10 on sheet Sheet5; DatasheetVersion: v1.15; PackageVersion: Rev. 1.11; PackageReference: CSG-325; PackageDescription: 324-Ball Wire-Bond Chip-Scale BGA, Body 15 x 15 mm, Pitch 0.8 mm; Maximum Distributed RAM: 400 Kb; Operating Temperature Range: Industrial; NexusDeviceID: XC7A35T-2CSG325I; Mounting Technology: Surface Mount; PartNumber: XC7A35T-2CSG325I; ComponentLink1Description: Manufacturer URL; ComponentLink1URL: http://www.xilinx.com/; ComponentLink2Description: Datasheet; ComponentLink2URL: http://www.xilinx.com/support/documentation/data_sheets/ds180_7Series_Overview.pdf; ComponentLink3Description: Package Specification; ComponentLink3URL: http://www.xilinx.com/support/documentation/user_guides/ug475_7Series_Pkg_Pinout.pdf; ComponentLink4Description: DC and Switching Characteristics; ComponentLink4URL: http://www.xilinx.com/support/documentation/data_sheets/ds181_Artix_7_Data_Sheet.pdf; ComponentLink5Description: Package File; ComponentLink5URL: http://www.xilinx.com/support/packagefiles/a7packages/xc7a200tsbg484pkg.txt; ComponentLink6Description: Packaging and Pinout; ComponentLink6URL: http://www.xilinx.com/support/documentation/user_guides/ug475_7Series_Pkg_Pinout.pdf
U11 = SN74LVC1G14DBVR: Single Schmitt-Trigger Inverter

## Sheet Sheet8.SchDoc
size A4
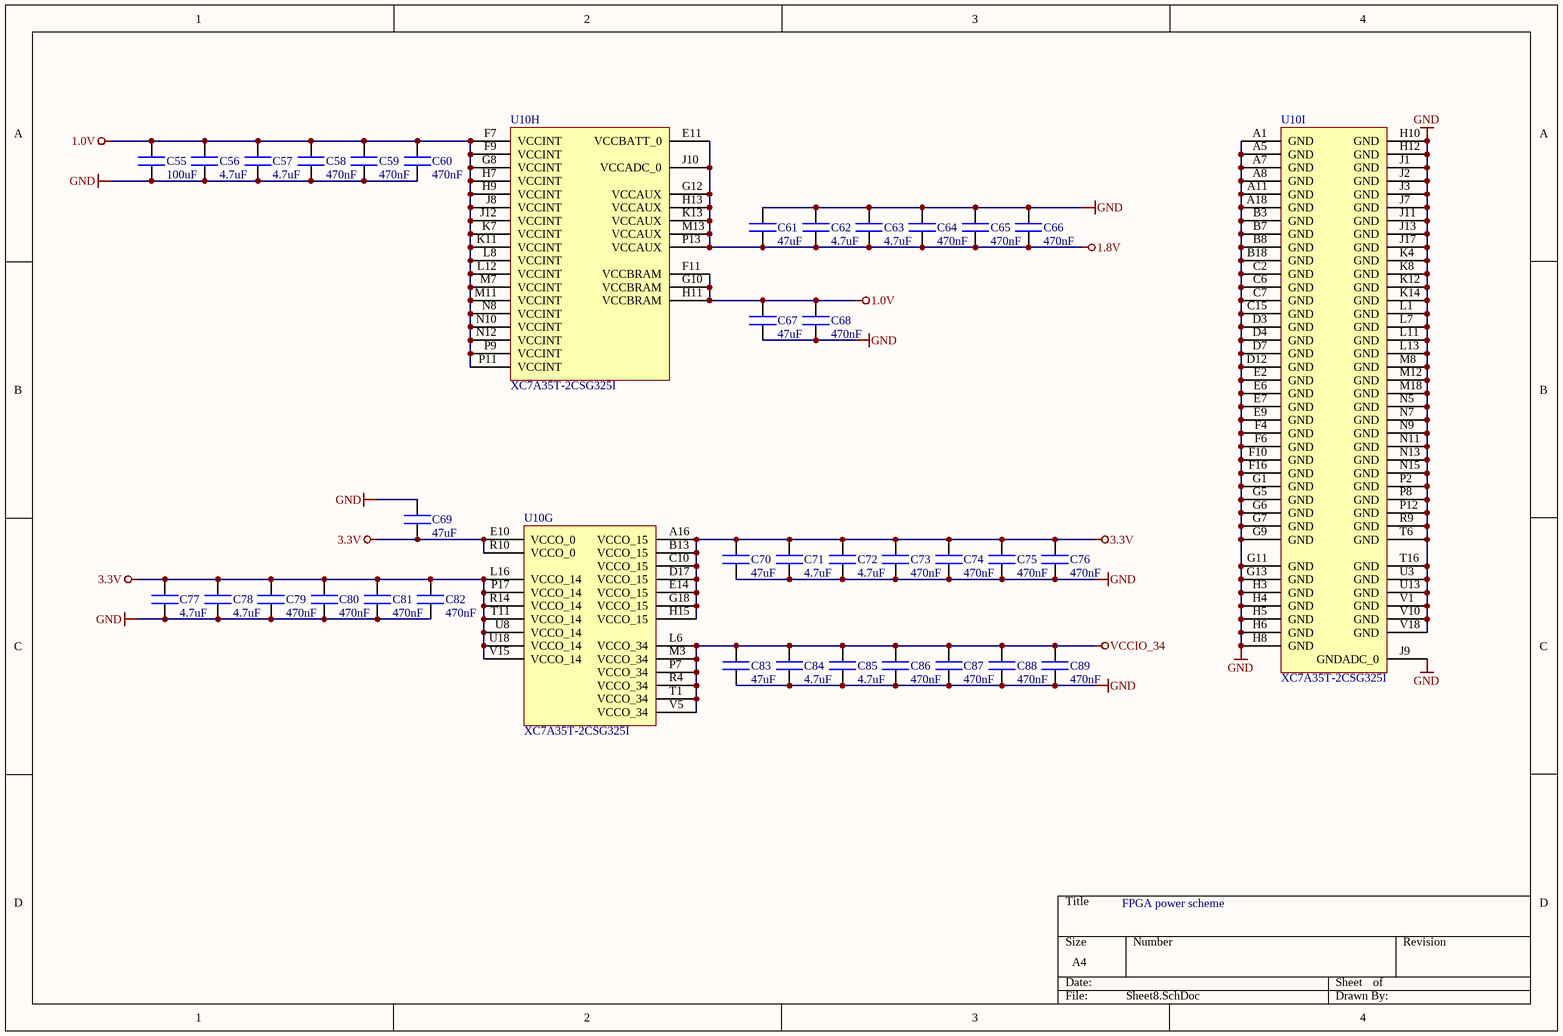
[diagram p7: Sheet8.SchDoc]

### Parts
C55  100uF  [CAPC3216X16N]
C56  4.7uF  [CAPC1005X05L]
C57  4.7uF  [CAPC1005X05L]
C58  470nF  [CAPC1005X05L]
C59  470nF  [CAPC1005X05L]
C60  470nF  [CAPC1005X05L]
C61  47uF  [CAPC2012X12N]
C62  4.7uF  [CAPC1005X05L]
C63  4.7uF  [CAPC1005X05L]
C64  470nF  [CAPC1005X05L]
C65  470nF  [CAPC1005X05L]
C66  470nF  [CAPC1005X05L]
C67  47uF  [CAPC2012X12N]
C68  470nF  [CAPC1005X05L]
C69  47uF  [CAPC2012X12N]
C70  47uF  [CAPC2012X12N]
C71  4.7uF  [CAPC1005X05L]
C72  4.7uF  [CAPC1005X05L]
C73  470nF  [CAPC1005X05L]
C74  470nF  [CAPC1005X05L]
C75  470nF  [CAPC1005X05L]
C76  470nF  [CAPC1005X05L]
C77  4.7uF  [CAPC1005X05L]
C78  4.7uF  [CAPC1005X05L]
C79  470nF  [CAPC1005X05L]
C80  470nF  [CAPC1005X05L]
C81  470nF  [CAPC1005X05L]
C82  470nF  [CAPC1005X05L]
C83  47uF  [CAPC2012X12N]
C84  4.7uF  [CAPC1005X05L]
C85  4.7uF  [CAPC1005X05L]
C86  470nF  [CAPC1005X05L]
C87  470nF  [CAPC1005X05L]
C88  470nF  [CAPC1005X05L]
C89  470nF  [CAPC1005X05L]
U10  XC7A35T-2CSG325I  [XC7A35T-2CSG325I]  (parts G,H,I of 9)

### Nets
1.0V: C55.2 C56.2 C57.2 C58.2 C59.2 C60.2 C67.2 C68.1 U10.F7(VCCINT) U10.F9(VCCINT) U10.F11(VCCBRAM) U10.G8(VCCINT) U10.G10(VCCBRAM) U10.H7(VCCINT) U10.H9(VCCINT) U10.H11(VCCBRAM) U10.J8(VCCINT) U10.J12(VCCINT) U10.K7(VCCINT) U10.K11(VCCINT) U10.L8(VCCINT) U10.L12(VCCINT) U10.M7(VCCINT) U10.M11(VCCINT) U10.N8(VCCINT) U10.N10(VCCINT) U10.N12(VCCINT) U10.P9(VCCINT) U10.P11(VCCINT)
1.8V: C61.1 C62.1 C63.1 C64.1 C65.1 C66.1 U10.E11(VCCBATT_0) U10.G12(VCCAUX) U10.H13(VCCAUX) U10.J10(VCCADC_0) U10.K13(VCCAUX) U10.M13(VCCAUX) U10.P13(VCCAUX)
3.3V: C69.2 C70.2 C71.2 C72.2 C73.2 C74.2 C75.2 C76.2 C77.2 C78.2 C79.2 C80.2 C81.2 C82.2 U10.A16(VCCO_15) U10.B13(VCCO_15) U10.C10(VCCO_15) U10.D17(VCCO_15) U10.E10(VCCO_0) U10.E14(VCCO_15) U10.G18(VCCO_15) U10.H15(VCCO_15) U10.L16(VCCO_14) U10.P17(VCCO_14) U10.R10(VCCO_0) U10.R14(VCCO_14) U10.T11(VCCO_14) U10.U8(VCCO_14) U10.U18(VCCO_14) U10.V15(VCCO_14)
GND: C55.1 C56.1 C57.1 C58.1 C59.1 C60.1 C61.2 C62.2 C63.2 C64.2 C65.2 C66.2 C67.1 C68.2 C69.1 C70.1 C71.1 C72.1 C73.1 C74.1 C75.1 C76.1 C77.1 C78.1 C79.1 C80.1 C81.1 C82.1 C83.1 C84.1 C85.1 C86.1 C87.1 C88.1 C89.1 U10.A1(GND) U10.A5(GND) U10.A7(GND) U10.A8(GND) U10.A11(GND) U10.A18(GND) U10.B3(GND) U10.B7(GND) U10.B8(GND) U10.B18(GND) U10.C2(GND) U10.C6(GND) U10.C7(GND) U10.C15(GND) U10.D3(GND) U10.D4(GND) U10.D7(GND) U10.D12(GND) U10.E2(GND) U10.E6(GND) U10.E7(GND) U10.E9(GND) U10.F4(GND) U10.F6(GND) U10.F10(GND) U10.F16(GND) U10.G1(GND) U10.G5(GND) U10.G6(GND) U10.G7(GND) U10.G9(GND) U10.G11(GND) U10.G13(GND) U10.H3(GND) U10.H4(GND) U10.H5(GND) U10.H6(GND) U10.H8(GND) U10.H10(GND) U10.H12(GND) U10.J1(GND) U10.J2(GND) U10.J3(GND) U10.J7(GND) U10.J9(GNDADC_0) U10.J11(GND) U10.J13(GND) U10.J17(GND) U10.K4(GND) U10.K8(GND) U10.K12(GND) U10.K14(GND) U10.L1(GND) U10.L7(GND) U10.L11(GND) U10.L13(GND) U10.M8(GND) U10.M12(GND) U10.M18(GND) U10.N5(GND) U10.N7(GND) U10.N9(GND) U10.N11(GND) U10.N13(GND) U10.N15(GND) U10.P2(GND) U10.P8(GND) U10.P12(GND) U10.R9(GND) U10.T6(GND) U10.T16(GND) U10.U3(GND) U10.U13(GND) U10.V1(GND) U10.V10(GND) U10.V18(GND)
VCCIO_34: C83.2 C84.2 C85.2 C86.2 C87.2 C88.2 C89.2 U10.L6(VCCO_34) U10.M3(VCCO_34) U10.P7(VCCO_34) U10.R4(VCCO_34) U10.T1(VCCO_34) U10.V5(VCCO_34)

### Notes on the sheet
- FPGA power scheme

### Library data of the parts
C55 = C1206: Ceramic Chip Capacitor; Value: 100uF
C56-C60 C62-C66 C68 C71-C82 C84-C89 = C0402: Ceramic Chip Capacitor
  C56 C57 C62 C63 C71 C72 C77 C78 C84 C85: Value: 4.7uF
  C58-C60 C64-C66 C68 C73-C76 C79-C82 C86-C89: Value: 470nF
C61 C67 C69 C70 C83 = C0805: Ceramic Chip Capacitor; Value: 47uF
U10 = XC7A35T-2CSG325I: as U10 on sheet Sheet5; DatasheetVersion: v1.15; PackageVersion: Rev. 1.11; PackageReference: CSG-325; PackageDescription: 324-Ball Wire-Bond Chip-Scale BGA, Body 15 x 15 mm, Pitch 0.8 mm; Maximum Distributed RAM: 400 Kb; Operating Temperature Range: Industrial; NexusDeviceID: XC7A35T-2CSG325I; Mounting Technology: Surface Mount; PartNumber: XC7A35T-2CSG325I; ComponentLink1Description: Manufacturer URL; ComponentLink1URL: http://www.xilinx.com/; ComponentLink2Description: Datasheet; ComponentLink2URL: http://www.xilinx.com/support/documentation/data_sheets/ds180_7Series_Overview.pdf; ComponentLink3Description: Package Specification; ComponentLink3URL: http://www.xilinx.com/support/documentation/user_guides/ug475_7Series_Pkg_Pinout.pdf; ComponentLink4Description: DC and Switching Characteristics; ComponentLink4URL: http://www.xilinx.com/support/documentation/data_sheets/ds181_Artix_7_Data_Sheet.pdf; ComponentLink5Description: Package File; ComponentLink5URL: http://www.xilinx.com/support/packagefiles/a7packages/xc7a200tsbg484pkg.txt; ComponentLink6Description: Packaging and Pinout; ComponentLink6URL: http://www.xilinx.com/support/documentation/user_guides/ug475_7Series_Pkg_Pinout.pdf

## Sheet Sheet9.SchDoc
size A4
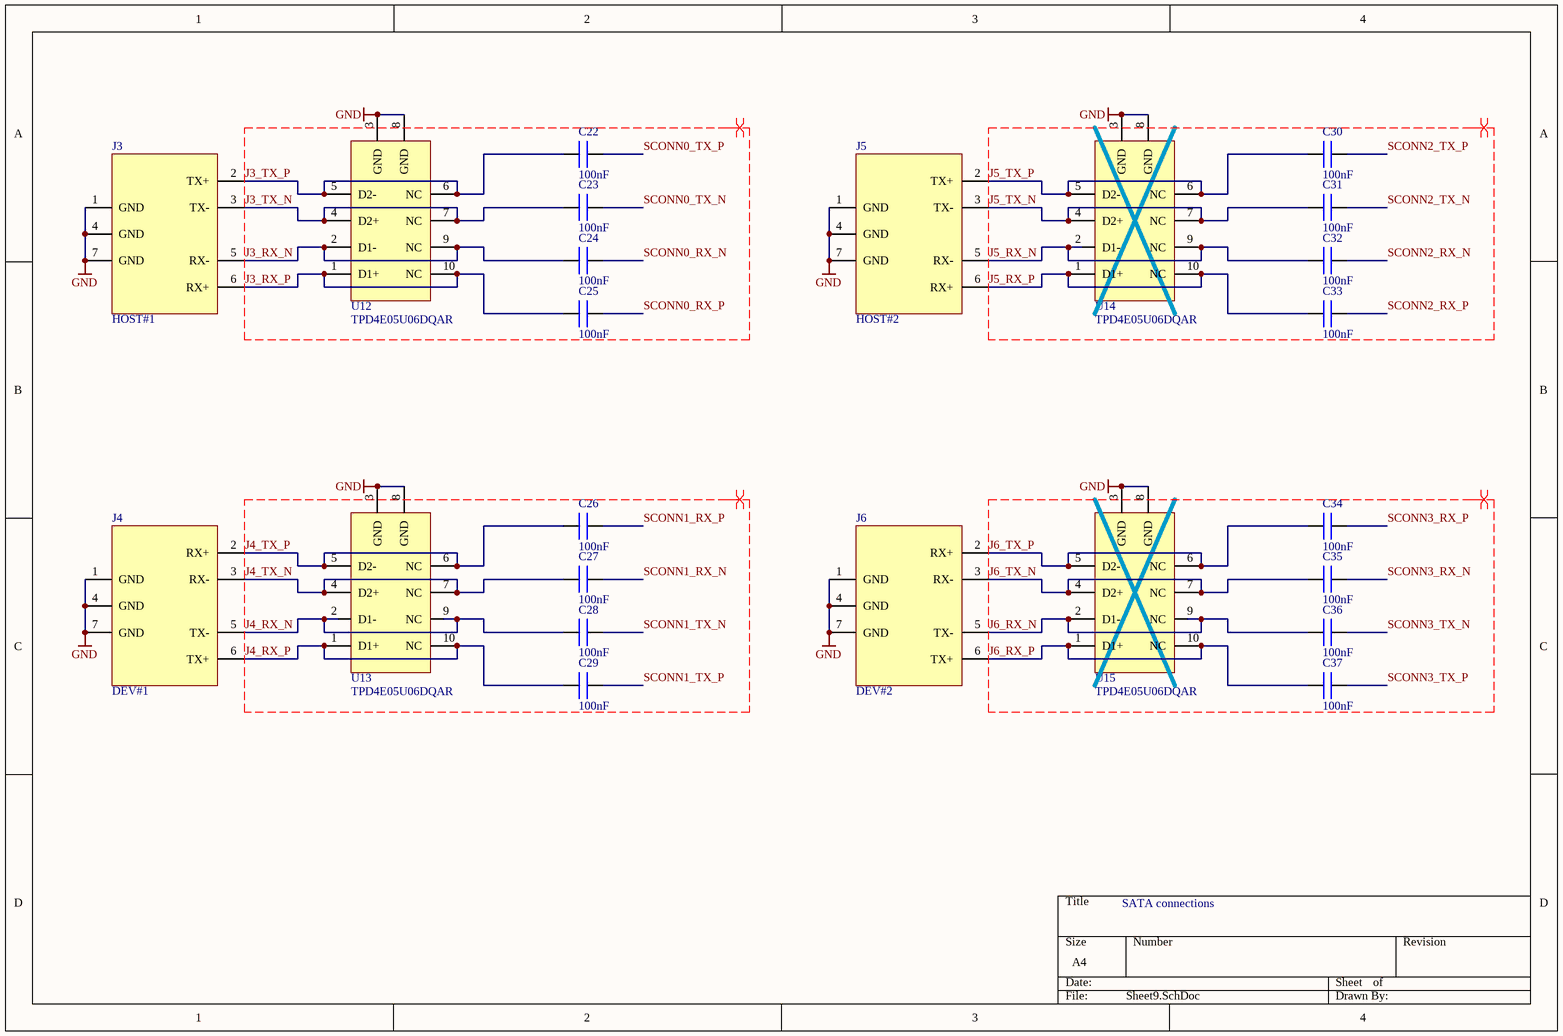
[diagram p8: Sheet9.SchDoc]

### Parts
C22  100nF  [CAPC1005X05N]
C23  100nF  [CAPC1005X05N]
C24  100nF  [CAPC1005X05N]
C25  100nF  [CAPC1005X05N]
C26  100nF  [CAPC1005X05N]
C27  100nF  [CAPC1005X05N]
C28  100nF  [CAPC1005X05N]
C29  100nF  [CAPC1005X05N]
C30  100nF  [CAPC1005X05N]
C31  100nF  [CAPC1005X05N]
C32  100nF  [CAPC1005X05N]
C33  100nF  [CAPC1005X05N]
C34  100nF  [CAPC1005X05N]
C35  100nF  [CAPC1005X05N]
C36  100nF  [CAPC1005X05N]
C37  100nF  [CAPC1005X05N]
J3  HOST#1  [5607-4200-SH]
J4  DEV#1  [5607-4200-SH]
J5  HOST#2  [5607-4200-SH]
J6  DEV#2  [5607-4200-SH]
U12  TPD4E05U06DQAR  [TPD4E05U06DQAR]
U13  TPD4E05U06DQAR  [TPD4E05U06DQAR]
U14  TPD4E05U06DQAR  [TPD4E05U06DQAR]
U15  TPD4E05U06DQAR  [TPD4E05U06DQAR]

### Nets
GND: J3.1(GND) J3.4(GND) J3.7(GND) J4.1(GND) J4.4(GND) J4.7(GND) J5.1(GND) J5.4(GND) J5.7(GND) J6.1(GND) J6.4(GND) J6.7(GND) U12.3(GND) U12.8(GND) U13.3(GND) U13.8(GND) U14.3(GND) U14.8(GND) U15.3(GND) U15.8(GND)
J3_RX_N: C24.2 J3.5(RX-) U12.2(D1-) U12.9(NC)
J3_RX_P: C25.2 J3.6(RX+) U12.1(D1+) U12.10(NC)
J3_TX_N: C23.2 J3.3(TX-) U12.4(D2+) U12.7(NC)
J3_TX_P: C22.2 J3.2(TX+) U12.5(D2-) U12.6(NC)
J4_RX_N: C28.2 J4.5(TX-) U13.2(D1-) U13.9(NC)
J4_RX_P: C29.2 J4.6(TX+) U13.1(D1+) U13.10(NC)
J4_TX_N: C27.2 J4.3(RX-) U13.4(D2+) U13.7(NC)
J4_TX_P: C26.2 J4.2(RX+) U13.5(D2-) U13.6(NC)
J5_RX_N: C32.2 J5.5(RX-) U14.2(D1-) U14.9(NC)
J5_RX_P: C33.2 J5.6(RX+) U14.1(D1+) U14.10(NC)
J5_TX_N: C31.2 J5.3(TX-) U14.4(D2+) U14.7(NC)
J5_TX_P: C30.2 J5.2(TX+) U14.5(D2-) U14.6(NC)
J6_RX_N: C36.2 J6.5(TX-) U15.2(D1-) U15.9(NC)
J6_RX_P: C37.2 J6.6(TX+) U15.1(D1+) U15.10(NC)
J6_TX_N: C35.2 J6.3(RX-) U15.4(D2+) U15.7(NC)
J6_TX_P: C34.2 J6.2(RX+) U15.5(D2-) U15.6(NC)
SCONN0_RX_N: C24.1
SCONN0_RX_P: C25.1
SCONN0_TX_N: C23.1
SCONN0_TX_P: C22.1
SCONN1_RX_N: C27.1
SCONN1_RX_P: C26.1
SCONN1_TX_N: C28.1
SCONN1_TX_P: C29.1
SCONN2_RX_N: C32.1
SCONN2_RX_P: C33.1
SCONN2_TX_N: C31.1
SCONN2_TX_P: C30.1
SCONN3_RX_N: C35.1
SCONN3_RX_P: C34.1
SCONN3_TX_N: C36.1
SCONN3_TX_P: C37.1

### Layout directives
differential pair: J3_RX_N, J3_RX_P, J3_TX_N, J3_TX_P, J4_RX_N, J4_RX_P, J4_TX_N, J4_TX_P, J5_RX_N, J5_RX_P, J5_TX_N, J5_TX_P, J6_RX_N, J6_RX_P, J6_TX_N, J6_TX_P, SCONN0_RX_N, SCONN0_RX_P, SCONN0_TX_N, SCONN0_TX_P, SCONN1_RX_N, SCONN1_RX_P, SCONN1_TX_N, SCONN1_TX_P, SCONN2_RX_N, SCONN2_RX_P, SCONN2_TX_N, SCONN2_TX_P, SCONN3_RX_N, SCONN3_RX_P, SCONN3_TX_N, SCONN3_TX_P

### Notes on the sheet
- SATA connections

### Library data of the parts
C22-C37 = C0402: Ceramic Chip Capacitor; Value: 100nF
J3 J5 = 5607-4200-SH-HOST: 3M SATA Series Connector (Host)
J4 J6 = 5607-4200-SH-DEVICE: 3M SATA Series Connector (Device)
U12-U15 = TPD4E05U06DQAR: 4-Channel ESD Protection Device for Super-Speed (Up to 6 Gbps)  Interface

## Sheet Sheet10.SchDoc
size A4
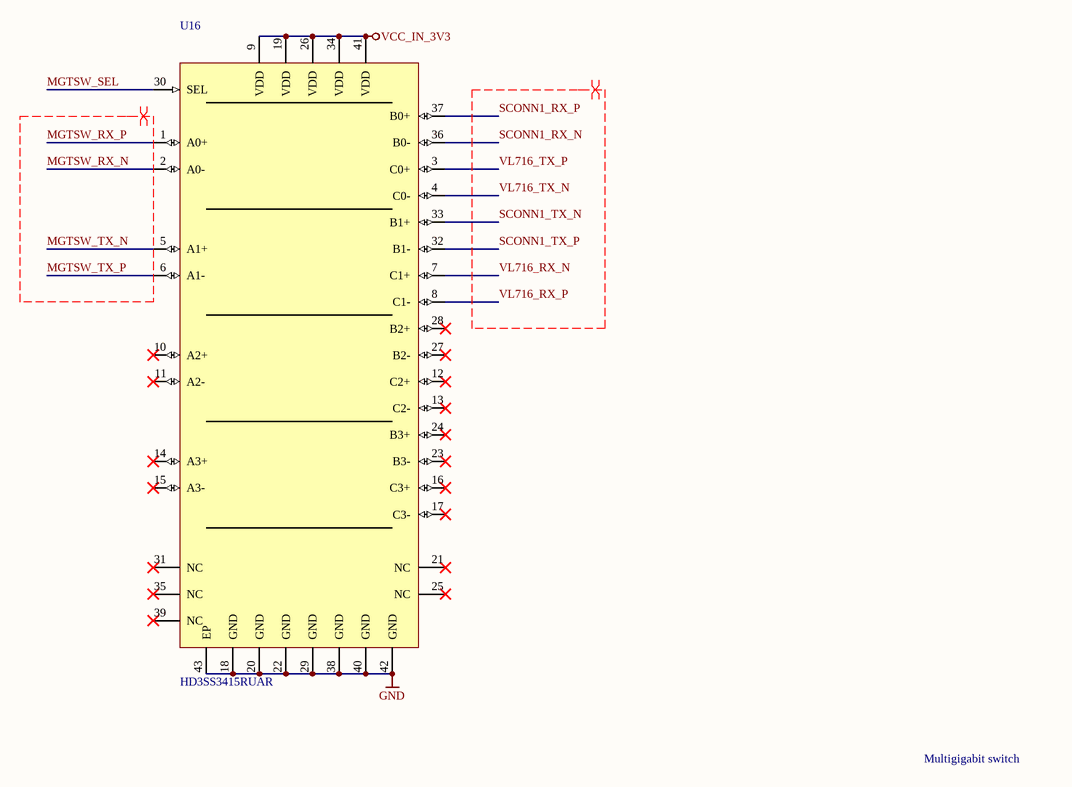
[diagram p9: Sheet10.SchDoc]

### Parts
U16  HD3SS3415RUAR  [HD3SS3415RUAR]

### Nets
GND: U16.18(GND) U16.20(GND) U16.22(GND) U16.29(GND) U16.38(GND) U16.40(GND) U16.42(GND) U16.43(EP)
VCC_IN_3V3: U16.9(VDD) U16.19(VDD) U16.26(VDD) U16.34(VDD) U16.41(VDD)
MGTSW_RX_N: U16.2(A0-)
MGTSW_RX_P: U16.1(A0+)
MGTSW_SEL: U16.30(SEL)
MGTSW_TX_N: U16.5(A1+)
MGTSW_TX_P: U16.6(A1-)
SCONN1_RX_N: U16.36(B0-)
SCONN1_RX_P: U16.37(B0+)
SCONN1_TX_N: U16.33(B1+)
SCONN1_TX_P: U16.32(B1-)
VL716_RX_N: U16.7(C1+)
VL716_RX_P: U16.8(C1-)
VL716_TX_N: U16.4(C0-)
VL716_TX_P: U16.3(C0+)

Not connected (* = marked no-connect by the designer): U16 10(A2+)* 11(A2-)* 12(C2+)* 13(C2-)* 14(A3+)* 15(A3-)* 16(C3+)* 17(C3-)* 21(NC)* 23(B3-)* 24(B3+)* 25(NC)* 27(B2-)* 28(B2+)* 31(NC)* 35(NC)* 39(NC)*

### Layout directives
differential pair: MGTSW_RX_N, MGTSW_RX_P, MGTSW_TX_N, MGTSW_TX_P, SCONN1_RX_N, SCONN1_RX_P, SCONN1_TX_N, SCONN1_TX_P, VL716_RX_N, VL716_RX_P, VL716_TX_N, VL716_TX_P

### Notes on the sheet
- Multigigabit switch

### Library data of the parts
U16 = HD3SS3415RUAR: 4-Channel High-Performance Differential Switch

## Sheet Sheet11.SchDoc
size A4
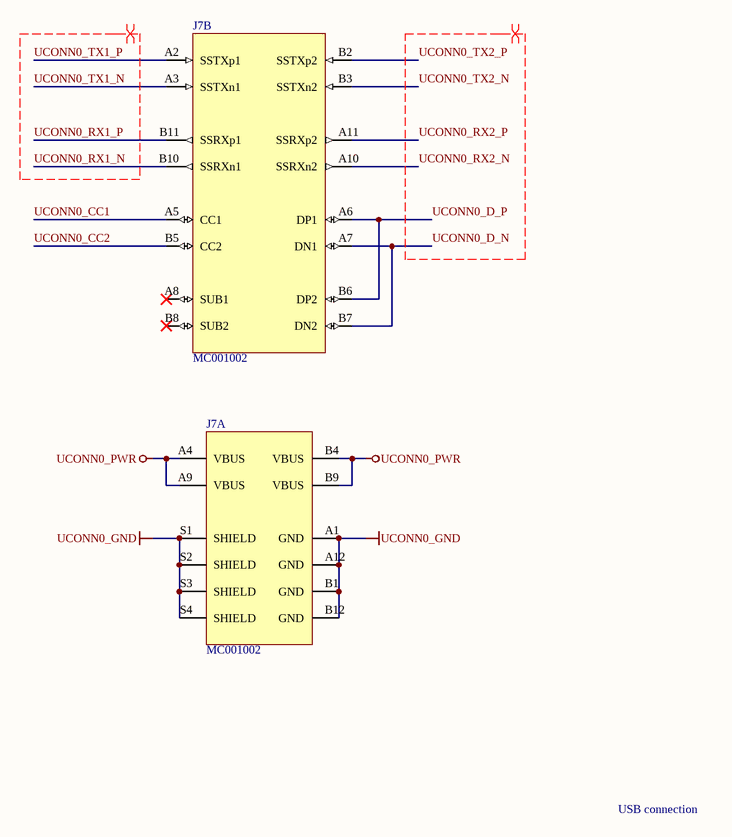
[diagram p10: Sheet11.SchDoc]

### Parts
J7  MC001002  [MC001002]  (parts A,B of 2)

### Nets
UCONN0_GND: J7.A1(GND) J7.A12(GND) J7.B1(GND) J7.B12(GND) J7.S1(SHIELD) J7.S2(SHIELD) J7.S3(SHIELD) J7.S4(SHIELD)
UCONN0_PWR: J7.A4(VBUS) J7.A9(VBUS) J7.B4(VBUS) J7.B9(VBUS)
UCONN0_CC1: J7.A5(CC1)
UCONN0_CC2: J7.B5(CC2)
UCONN0_D_N: J7.A7(DN1) J7.B7(DN2)
UCONN0_D_P: J7.A6(DP1) J7.B6(DP2)
UCONN0_RX1_N: J7.B10(SSRXn1)
UCONN0_RX1_P: J7.B11(SSRXp1)
UCONN0_RX2_N: J7.A10(SSRXn2)
UCONN0_RX2_P: J7.A11(SSRXp2)
UCONN0_TX1_N: J7.A3(SSTXn1)
UCONN0_TX1_P: J7.A2(SSTXp1)
UCONN0_TX2_N: J7.B3(SSTXn2)
UCONN0_TX2_P: J7.B2(SSTXp2)

Not connected (* = marked no-connect by the designer): J7 A8(SUB1)* B8(SUB2)*

### Layout directives
differential pair: UCONN0_D_N, UCONN0_D_P, UCONN0_RX1_N, UCONN0_RX1_P, UCONN0_RX2_N, UCONN0_RX2_P, UCONN0_TX1_N, UCONN0_TX1_P, UCONN0_TX2_N, UCONN0_TX2_P

### Notes on the sheet
- USB connection

### Library data of the parts
J7 = MC001002: USB C Female SMT Connector

## Sheet Sheet12.SchDoc
size A4
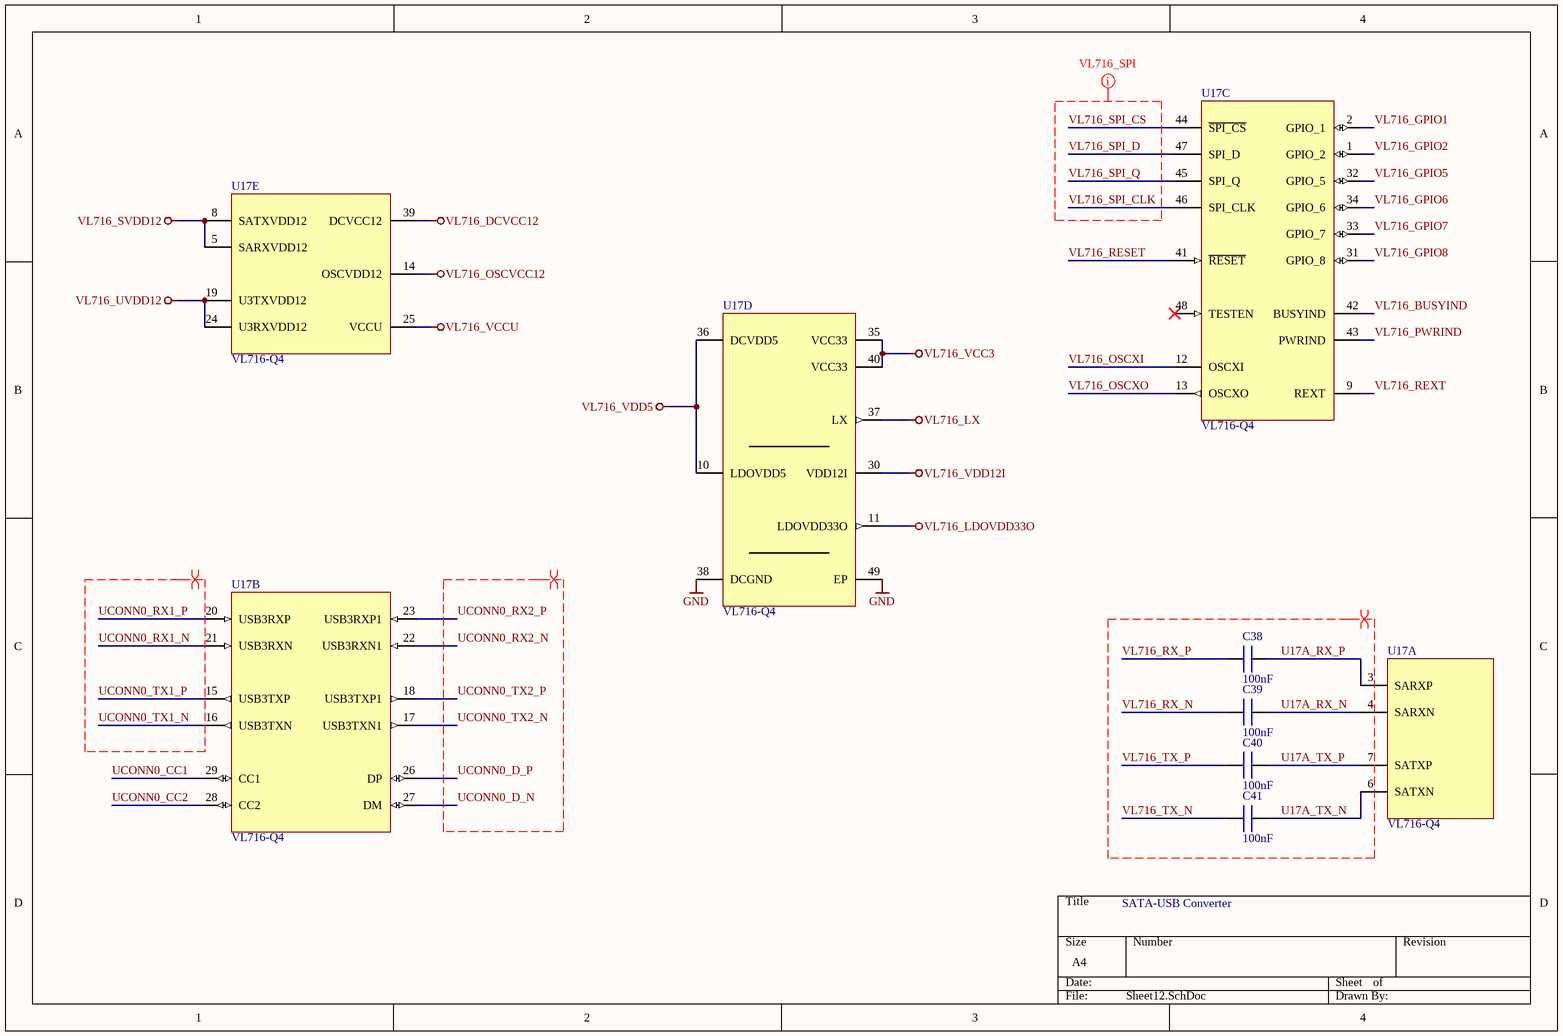
[diagram p11: Sheet12.SchDoc]

### Parts
C38  100nF  [CAPC1005X05N]
C39  100nF  [CAPC1005X05N]
C40  100nF  [CAPC1005X05N]
C41  100nF  [CAPC1005X05N]
U17  VL716-Q4  [VL716-Q4]  (parts A,B,C,D,E of 5)

### Nets
GND: U17.38(DCGND) U17.49(EP)
VL716_DCVCC12: U17.39(DCVCC12)
VL716_LDOVDD33O: U17.11(LDOVDD33O)
VL716_LX: U17.37(LX)
VL716_OSCVCC12: U17.14(OSCVDD12)
VL716_SVDD12: U17.5(SARXVDD12) U17.8(SATXVDD12)
VL716_UVDD12: U17.19(U3TXVDD12) U17.24(U3RXVDD12)
VL716_VCC3: U17.35(VCC33) U17.40(VCC33)
VL716_VCCU: U17.25(VCCU)
VL716_VDD5: U17.10(LDOVDD5) U17.36(DCVDD5)
VL716_VDD12I: U17.30(VDD12I)
U17A_RX_N: C39.1 U17.4(SARXN)
U17A_RX_P: C38.1 U17.3(SARXP)
U17A_TX_N: C41.1 U17.6(SATXN)
U17A_TX_P: C40.1 U17.7(SATXP)
UCONN0_CC1: U17.29(CC1)
UCONN0_CC2: U17.28(CC2)
UCONN0_D_N: U17.27(DM)
UCONN0_D_P: U17.26(DP)
UCONN0_RX1_N: U17.21(USB3RXN)
UCONN0_RX1_P: U17.20(USB3RXP)
UCONN0_RX2_N: U17.22(USB3RXN1)
UCONN0_RX2_P: U17.23(USB3RXP1)
UCONN0_TX1_N: U17.16(USB3TXN)
UCONN0_TX1_P: U17.15(USB3TXP)
UCONN0_TX2_N: U17.17(USB3TXN1)
UCONN0_TX2_P: U17.18(USB3TXP1)
VL716_BUSYIND: U17.42(BUSYIND)
VL716_GPIO1: U17.2(GPIO_1)
VL716_GPIO2: U17.1(GPIO_2)
VL716_GPIO5: U17.32(GPIO_5)
VL716_GPIO6: U17.34(GPIO_6)
VL716_GPIO7: U17.33(GPIO_7)
VL716_GPIO8: U17.31(GPIO_8)
VL716_OSCXI: U17.12(OSCXI)
VL716_OSCXO: U17.13(OSCXO)
VL716_PWRIND: U17.43(PWRIND)
VL716_RESET: U17.41(~{RESET})
VL716_REXT: U17.9(REXT)
VL716_RX_N: C39.2
VL716_RX_P: C38.2
VL716_SPI_CLK: U17.46(SPI_CLK)
VL716_SPI_CS: U17.44(~{SPI_CS})
VL716_SPI_D: U17.47(SPI_D)
VL716_SPI_Q: U17.45(SPI_Q)
VL716_TX_N: C41.2
VL716_TX_P: C40.2

Not connected (* = marked no-connect by the designer): U17 48(TESTEN)*

### Layout directives
differential pair: U17A_RX_N, U17A_RX_P, U17A_TX_N, U17A_TX_P, UCONN0_D_N, UCONN0_D_P, UCONN0_RX1_N, UCONN0_RX1_P, UCONN0_RX2_N, UCONN0_RX2_P, UCONN0_TX1_N, UCONN0_TX1_P, UCONN0_TX2_N, UCONN0_TX2_P, VL716_RX_N, VL716_RX_P, VL716_TX_N, VL716_TX_P
net class VL716_SPI: VL716_SPI_CLK, VL716_SPI_CS, VL716_SPI_D, VL716_SPI_Q

### Notes on the sheet
- SATA-USB Converter

### Library data of the parts
C38-C41 = C0402: Ceramic Chip Capacitor; Value: 100nF
U17 = VL716-Q4: USB 3.1 to SATA 6Gb/s bridge controller with USB type-C connector support

## Sheet Sheet13.SchDoc
size A4
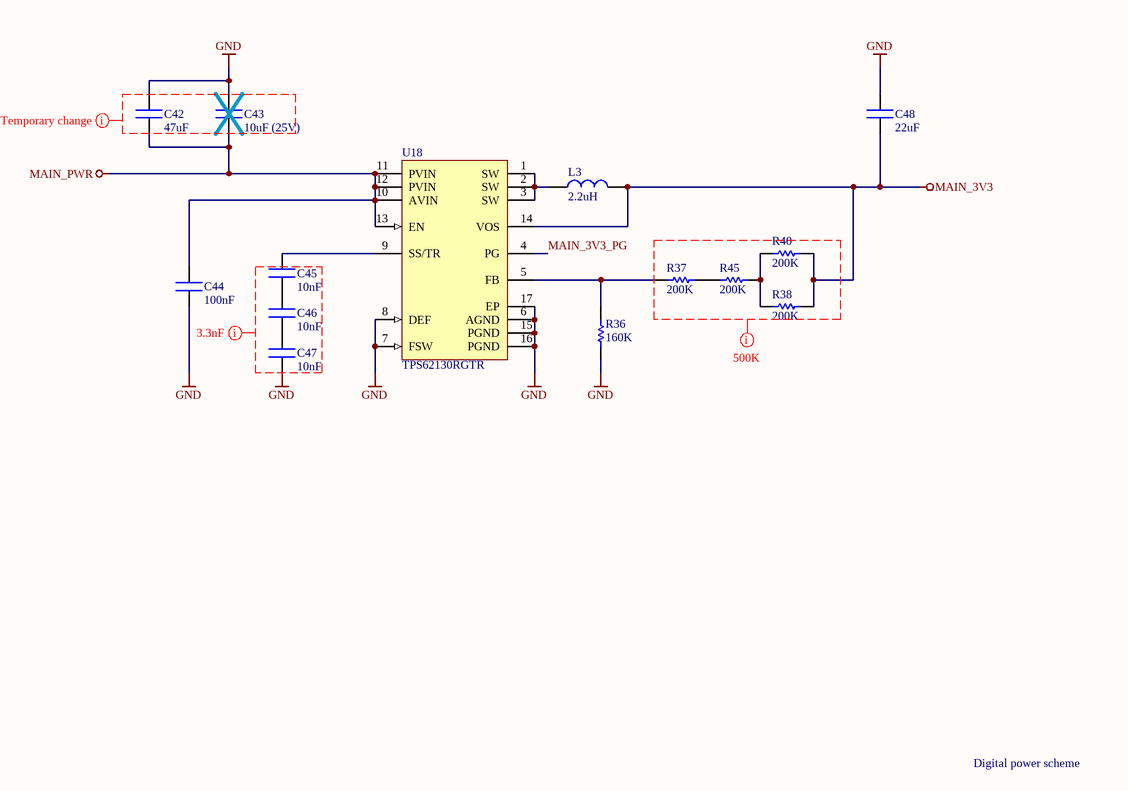
[diagram p12: Sheet13.SchDoc]

### Parts
C42  47uF  [CAPC2012X12N]
C43  10uF (25V)  [CAPC3216X16N]
C44  100nF  [CAPC1608X08N]
C45  10nF  [CAPC1005X05N]
C46  10nF  [CAPC1005X05N]
C47  10nF  [CAPC1005X05N]
C48  22uF  [CAPC1608X08N]
L3  2.2uH  [IHLP1212BZER2R2M11]
R36  160K  [RESC1005X05N]
R37  200K  [RESC1005X05N]
R38  200K  [RESC1005X05N]
R40  200K  [RESC1005X05N]
R45  200K  [RESC1005X05N]
U18  TPS62130RGTR  [TPS62130RGTR]

### Nets
GND: C42.2 C43.2 C44.1 C47.1 C48.2 R36.1 U18.6(AGND) U18.7(FSW) U18.8(DEF) U18.15(PGND) U18.16(PGND) U18.17(EP)
MAIN_3V3: C48.1 L3.2 R38.2 R40.2 U18.14(VOS)
MAIN_PWR: C42.1 C43.1 C44.2 U18.10(AVIN) U18.11(PVIN) U18.12(PVIN) U18.13(EN)
MAIN_3V3_PG: U18.4(PG)
NetC45_1: C45.1 C46.2
NetC45_2: C45.2 U18.9(SS/TR)
NetC46_1: C46.1 C47.2
NetL3_1: L3.1 U18.1(SW) U18.2(SW) U18.3(SW)
NetR36_2: R36.2 R37.2 U18.5(FB)
NetR37_1: R37.1 R45.2
NetR38_1: R38.1 R40.1 R45.1

### Layout directives
mark named 3.3nF: GND
mark named Temporary change: (no net found under the mark)
mark named 500K: (no net found under the mark)

### Notes on the sheet
- Digital power scheme

### Library data of the parts
C42 = C0805: Ceramic Chip Capacitor; Value: 47uF
C43 = C1206: Ceramic Chip Capacitor; Value: 10uF (25V)
C44 C48 = C0603: Ceramic Chip Capacitor
  C44: Value: 100nF
  C48: Value: 22uF
C45-C47 = C0402: Ceramic Chip Capacitor; Value: 10nF
L3 = IHLP1212BZER2R2M11: Commercial Inductors, Low DCR Series; Value: 2.2uH
R36-R38 R40 R45 = R0402: Ceramic Chip Resistor
  R36: Value: 160K
  R37 R38 R40 R45: Value: 200K
U18 = TPS62130RGTR: Buck Step Down Regulator with 3 to 17 V Input and 0.9 to 6 V Output, -40 to 85 degC, 16-Pin QFN (RGT), Green (RoHS & no Sb/Br); Manufacturer: Texas Instruments; Duty Cycle(Max)(%): 100; Iout(Max)(A): 3; Iq(Typ)(mA): 0.017; Rating: Catalog; Regulated Outputs(#): 1; SubFamily: Step-Down Regulator; Switch Current Limit(Typ)(A): 4.2; Synchronous Rectification: TRUE; Vin(Max)(V): 17; Vout(Max)(V): 6; Vout(Min)(V): 0.9; DatasheetVersion: SLVSAG7; PackageVersion: revH, Oct-2011; PackageReference: RGT16-1700X1700TP; PackageDescription: 16-Pin Plastic Quad Flat No-Lead, 3 x 3 mm Body, 0.5 mm Pitch, 1.7 x 1.7 mm Exposed Pad; Supplier 1: Digi-Key; Supplier Part Number 1: TPS62130RGTR-ND; Supplier 2: Newark; Supplier Part Number 2: 74T5526; Supplier 3: Mouser; Supplier Part Number 3: 595-TPS62130RGTR; Eco-Plan: Green (RoHS & no Sb/Br); Topology: Buck; Vin(Min)(V): 3; Mounting Technology: Surface Mount; Code_JEDEC: MO-220; PartNumber: TPS62130RGTR; ComponentLink1Description: Datasheet; ComponentLink1URL: http://www.ti.com/general/docs/lit/getliterature.tsp?genericPartNumber=TPS62130&fileType=pdf; ComponentLink2Description: Package Specification; ComponentLink2URL: http://www.ti.com/litv/pdf/mpqf119g; ComponentLink3Description: URL Link1; ComponentLink3URL: Samples URL:http://www.ti.com/product/tps62130#samples

## Nets that join several sheets
1.0V: Sheet1 (C2.2 R1.2 U1.8), Sheet3 (J1.58), Sheet8 (29 pins)
1.0V_MGT: Sheet2 (C11.2 R10.2 U4.9 U4.10), Sheet3 (J1.55), Sheet6 (7 pins)
1.2V_MGT: Sheet2 (5 pins), Sheet3 (J1.53), Sheet6 (9 pins)
1.8V: Sheet1 (C4.2 R15.2 R16.2 U2.3), Sheet3 (J1.60), Sheet8 (13 pins)
1.35V: Sheet2 (9 pins), Sheet3 (J1.56)
3.3V: Sheet1 (C7.2 Q1.6 U6.4), Sheet3 (7 pins), Sheet5 (R29.1), Sheet7 (9 pins), Sheet8 (30 pins)
GND: Sheet1 (17 pins), Sheet2 (20 pins), Sheet3 (10 pins), Sheet4 (C18.2 C19.2 U7.2 U8.3), Sheet5 (8 pins), Sheet6 (6 pins), Sheet7 (8 pins), Sheet8 (111 pins), Sheet9 (20 pins), Sheet10 (8 pins), Sheet12 (U17.38 U17.49), Sheet13 (12 pins)
MAIN_3V3: Sheet3 (J1.40), Sheet13 (5 pins)
MAIN_PWR: Sheet3 (J8.4 J8.6 J8.18 J8.20), Sheet13 (7 pins)
UCONN0_GND: Sheet3 (J8.21 J8.23), Sheet11 (8 pins)
UCONN0_PWR: Sheet3 (J8.17 J8.19 J8.27), Sheet11 (J7.A4 J7.A9 J7.B4 J7.B9)
VCC_IN_3V3: Sheet1 (8 pins), Sheet2 (10 pins), Sheet3 (5 pins), Sheet4 (L1.2 L2.2), Sheet10 (5 pins)
VCCIO_34: Sheet3 (J1.52), Sheet8 (13 pins)
VL716_DCVCC12: Sheet3 (J8.52), Sheet12 (U17.39)
VL716_LDOVDD33O: Sheet3 (J8.36), Sheet12 (U17.11)
VL716_LX: Sheet3 (J8.32), Sheet12 (U17.37)
VL716_OSCVCC12: Sheet3 (J8.60), Sheet12 (U17.14)
VL716_SVDD12: Sheet3 (J8.54), Sheet12 (U17.5 U17.8)
VL716_UVDD12: Sheet3 (J8.58), Sheet12 (U17.19 U17.24)
VL716_VCC3: Sheet3 (J8.30), Sheet12 (U17.35 U17.40)
VL716_VCCU: Sheet3 (J8.56), Sheet12 (U17.25)
VL716_VDD5: Sheet3 (J8.28), Sheet12 (U17.10 U17.36)
VL716_VDD12I: Sheet3 (J8.34), Sheet12 (U17.30)
ADV_MGT_CLK_N: Sheet3 (J1.30), Sheet6 (U10.B5)
ADV_MGT_CLK_P: Sheet3 (J1.28), Sheet6 (U10.B6)
B14_L0: Sheet3 (J2.53), Sheet5 (U10.L14)
B14_L25: Sheet3 (J2.57), Sheet5 (U10.U10)
B15_L11_N: Sheet3 (J2.41), Sheet5 (U10.C13)
B15_L11_P: Sheet3 (J2.42), Sheet5 (U10.D13)
B15_L12_N: Sheet3 (J2.37), Sheet5 (U10.D14)
B15_L12_P: Sheet3 (J2.35), Sheet5 (U10.E13)
B15_L13_N: Sheet3 (J2.38), Sheet5 (U10.D15)
B15_L13_P: Sheet3 (J2.36), Sheet5 (U10.E15)
B15_L14_N: Sheet3 (J2.39), Sheet5 (U10.D16)
B15_L14_P: Sheet3 (J2.40), Sheet5 (U10.E16)
B15_L15_N: Sheet3 (J2.46), Sheet5 (U10.A17)
B15_L15_P: Sheet3 (J2.45), Sheet5 (U10.B16)
B15_L16_N: Sheet3 (J2.43), Sheet5 (U10.B17)
B15_L16_P: Sheet3 (J2.44), Sheet5 (U10.C16)
BOOTMODE: Sheet3 (J2.51), Sheet7 (R27.2 U10.R12 U11.2)
CFGVBS: Sheet3 (J1.22 J1.24), Sheet7 (U10.E12)
CLK_25M: Sheet3 (J1.25), Sheet4 (U7.3), Sheet5 (R31.2)
CLK_200M_N: Sheet4 (C20.1), Sheet6 (U10.D5)
CLK_200M_P: Sheet4 (C21.1), Sheet6 (U10.D6)
MAIN_3V3_PG: Sheet3 (J1.38), Sheet13 (U18.4)
MGT_PWR: Sheet3 (J1.19), Sheet5 (R29.2 U10.M15)
MGTSW_RX_N: Sheet6 (U10.C3), Sheet10 (U16.2)
MGTSW_RX_P: Sheet6 (U10.C4), Sheet10 (U16.1)
MGTSW_SEL: Sheet5 (U10.D10), Sheet10 (U16.30)
MGTSW_TX_N: Sheet6 (U10.D1), Sheet10 (U16.5)
MGTSW_TX_P: Sheet6 (U10.D2), Sheet10 (U16.6)
PROG_B: Sheet3 (J2.49), Sheet7 (D1.2)
PUDC: Sheet5 (U10.J18), Sheet7 (R28.1)
PWR_RESET: Sheet1 (R17.2 R18.2 U6.3), Sheet3 (J1.54), Sheet7 (D1.3)
Q1_EN: Sheet1 (Q1.3), Sheet3 (J1.5 J1.17)
Q1_QOD: Sheet1 (Q1.5), Sheet3 (J1.7)
SCONN0_RX_N: Sheet6 (U10.G3), Sheet9 (C24.1)
SCONN0_RX_P: Sheet6 (U10.G4), Sheet9 (C25.1)
SCONN0_TX_N: Sheet6 (U10.B1), Sheet9 (C23.1)
SCONN0_TX_P: Sheet6 (U10.B2), Sheet9 (C22.1)
SCONN1_RX_N: Sheet9 (C27.1), Sheet10 (U16.36)
SCONN1_RX_P: Sheet9 (C26.1), Sheet10 (U16.37)
SCONN1_TX_N: Sheet9 (C28.1), Sheet10 (U16.33)
SCONN1_TX_P: Sheet9 (C29.1), Sheet10 (U16.32)
SCONN2_RX_N: Sheet6 (U10.A3), Sheet9 (C32.1)
SCONN2_RX_P: Sheet6 (U10.A4), Sheet9 (C33.1)
SCONN2_TX_N: Sheet6 (U10.F1), Sheet9 (C31.1)
SCONN2_TX_P: Sheet6 (U10.F2), Sheet9 (C30.1)
SCONN3_RX_N: Sheet6 (U10.E3), Sheet9 (C35.1)
SCONN3_RX_P: Sheet6 (U10.E4), Sheet9 (C34.1)
SCONN3_TX_N: Sheet6 (U10.H1), Sheet9 (C36.1)
SCONN3_TX_P: Sheet6 (U10.H2), Sheet9 (C37.1)
SPI-CLK: Sheet3 (J2.8), Sheet7 (U9.6 U10.E8)
SPI-CS: Sheet3 (J2.12), Sheet5 (U10.L15), Sheet7 (R23.2 U9.1)
SPI-DQ0: Sheet3 (J2.10), Sheet5 (U10.K16), Sheet7 (U9.5)
SPI-DQ1: Sheet3 (J2.4), Sheet5 (U10.L17), Sheet7 (U9.2)
SPI-DQ2: Sheet3 (J2.2), Sheet5 (U10.J15), Sheet7 (U9.3)
SPI-DQ3: Sheet3 (J2.6), Sheet5 (U10.J16), Sheet7 (U9.7)
TCK: Sheet3 (J2.58), Sheet7 (U10.F8)
TDI: Sheet3 (J2.52), Sheet7 (U10.T9)
TDO: Sheet3 (J2.54), Sheet7 (U10.T8)
TMS: Sheet3 (J2.50), Sheet7 (U10.R8)
U1_EN: Sheet1 (U1.1), Sheet3 (J1.2)
U1_PG: Sheet1 (R4.1 U1.2), Sheet3 (J1.4 J1.6)
U2_EN: Sheet1 (U2.2), Sheet3 (J1.3)
U3_EN: Sheet2 (U3.1), Sheet3 (J1.12 J1.20)
U3_PG: Sheet2 (R5.1 U3.2), Sheet3 (J1.14)
U4_EN: Sheet2 (U4.5), Sheet3 (J1.13)
U4_PG: Sheet2 (R8.1 U4.3), Sheet3 (J1.15)
U5_EN: Sheet2 (U5.5), Sheet3 (J1.16)
U5_PG: Sheet2 (R11.1 U5.3), Sheet3 (J1.18)
UCONN0_CC1: Sheet11 (J7.A5), Sheet12 (U17.29)
UCONN0_CC2: Sheet11 (J7.B5), Sheet12 (U17.28)
UCONN0_D_N: Sheet11 (J7.A7 J7.B7), Sheet12 (U17.27)
UCONN0_D_P: Sheet11 (J7.A6 J7.B6), Sheet12 (U17.26)
UCONN0_RX1_N: Sheet11 (J7.B10), Sheet12 (U17.21)
UCONN0_RX1_P: Sheet11 (J7.B11), Sheet12 (U17.20)
UCONN0_RX2_N: Sheet11 (J7.A10), Sheet12 (U17.22)
UCONN0_RX2_P: Sheet11 (J7.A11), Sheet12 (U17.23)
UCONN0_TX1_N: Sheet11 (J7.A3), Sheet12 (U17.16)
UCONN0_TX1_P: Sheet11 (J7.A2), Sheet12 (U17.15)
UCONN0_TX2_N: Sheet11 (J7.B3), Sheet12 (U17.17)
UCONN0_TX2_P: Sheet11 (J7.B2), Sheet12 (U17.18)
VL716_BUSYIND: Sheet3 (J8.46), Sheet5 (U10.M2), Sheet12 (U17.42)
VL716_GPIO1: Sheet3 (J8.39), Sheet5 (U10.K3), Sheet12 (U17.2)
VL716_GPIO2: Sheet3 (J8.41), Sheet5 (U10.K1), Sheet12 (U17.1)
VL716_GPIO5: Sheet3 (J8.47), Sheet5 (U10.L4), Sheet12 (U17.32)
VL716_GPIO6: Sheet3 (J8.48), Sheet5 (U10.L5), Sheet12 (U17.34)
VL716_GPIO7: Sheet3 (J8.50), Sheet5 (U10.L3), Sheet12 (U17.33)
VL716_GPIO8: Sheet3 (J8.49), Sheet5 (U10.M5), Sheet12 (U17.31)
VL716_OSCXI: Sheet3 (J8.42), Sheet12 (U17.12)
VL716_OSCXO: Sheet3 (J8.44), Sheet12 (U17.13)
VL716_PWRIND: Sheet3 (J8.43), Sheet5 (U10.L2), Sheet12 (U17.43)
VL716_RESET: Sheet3 (J8.45), Sheet5 (U10.M1), Sheet12 (U17.41)
VL716_REXT: Sheet3 (J8.38), Sheet12 (U17.9)
VL716_RX_N: Sheet10 (U16.7), Sheet12 (C39.2)
VL716_RX_P: Sheet10 (U16.8), Sheet12 (C38.2)
VL716_SPI_CLK: Sheet3 (J2.5), Sheet5 (U10.J5), Sheet12 (U17.46)
VL716_SPI_CS: Sheet3 (J2.1), Sheet5 (U10.K5), Sheet12 (U17.44)
VL716_SPI_D: Sheet3 (J2.7), Sheet5 (U10.J6), Sheet12 (U17.47)
VL716_SPI_Q: Sheet3 (J2.3), Sheet5 (U10.K6), Sheet12 (U17.45)
VL716_TX_N: Sheet10 (U16.4), Sheet12 (C41.2)
VL716_TX_P: Sheet10 (U16.3), Sheet12 (C40.2)